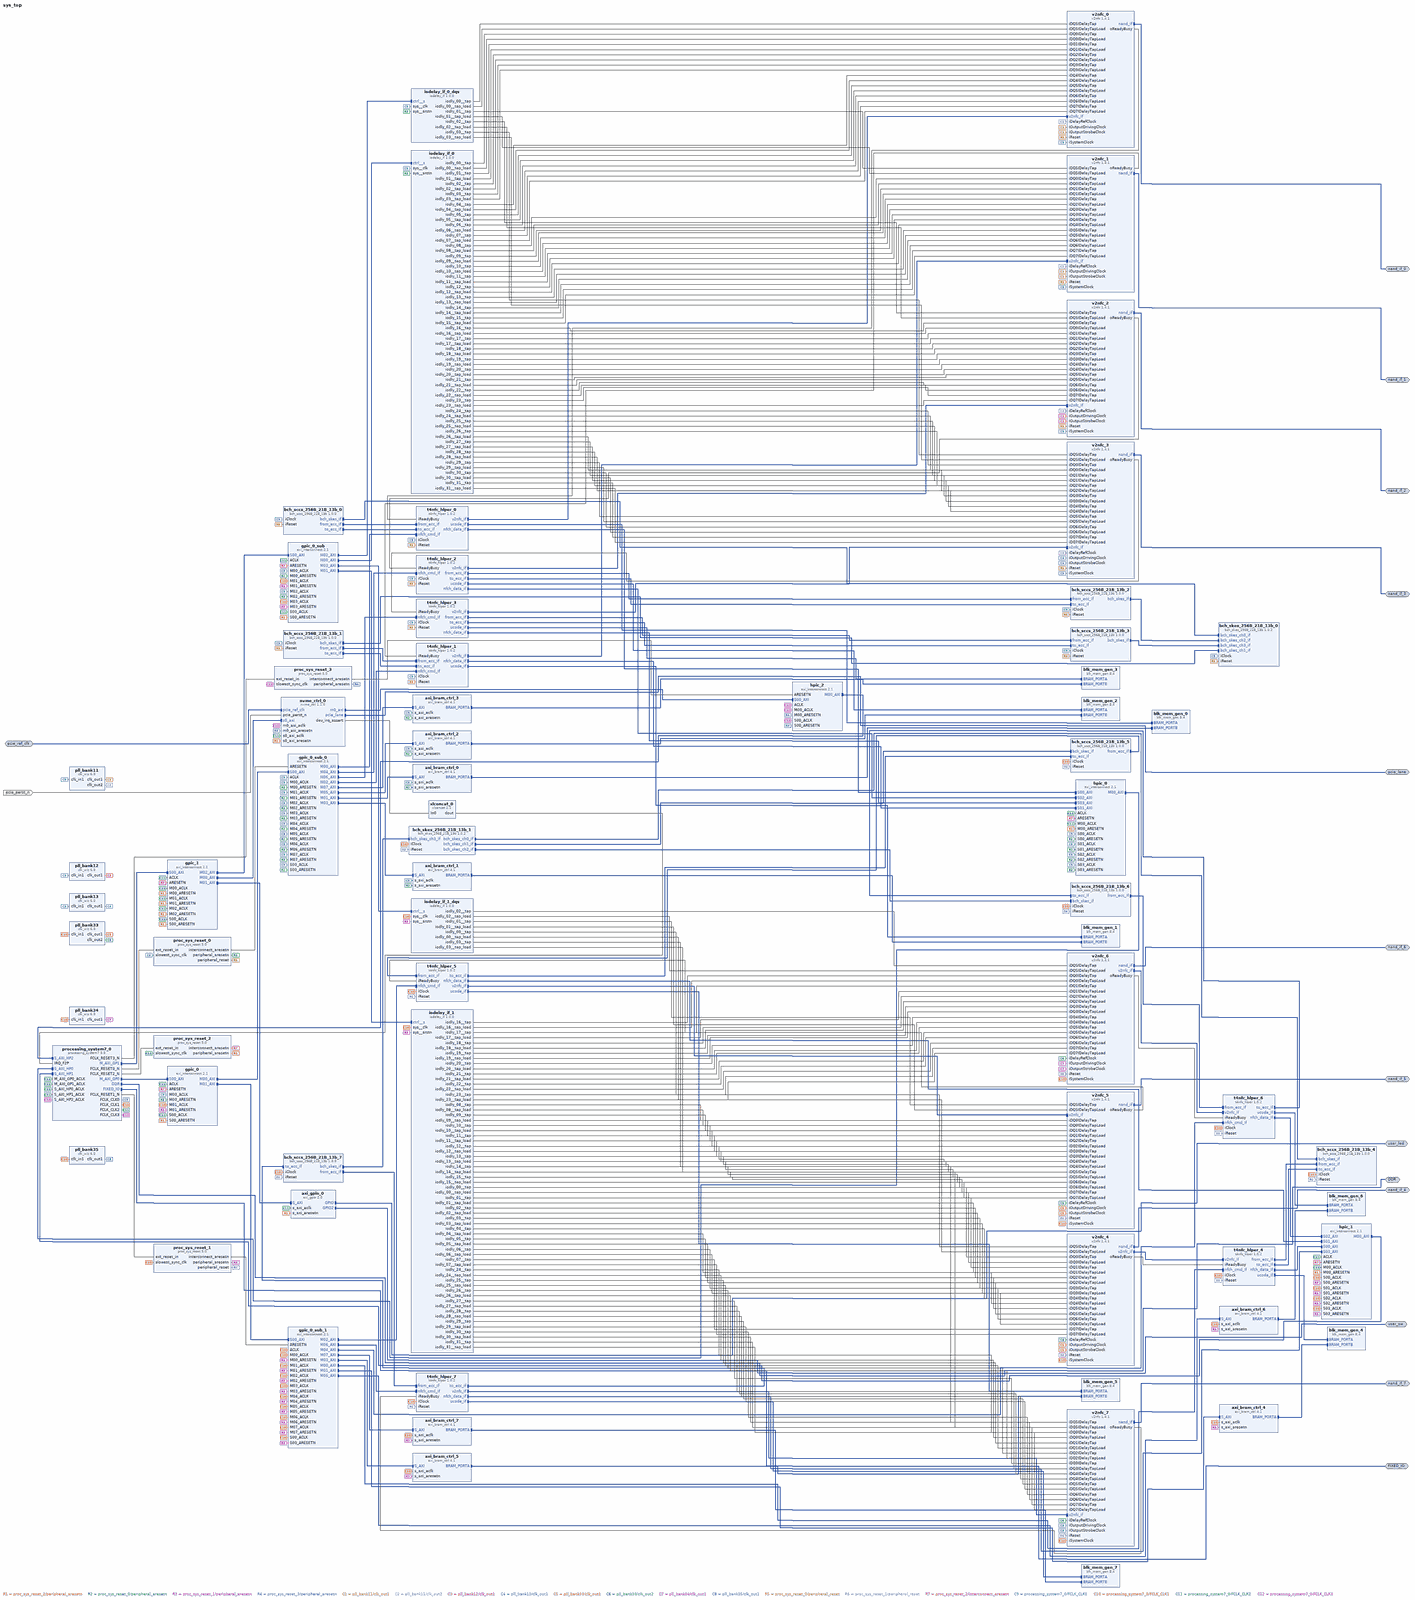
[diagram p0: block diagram of the top level, whole]
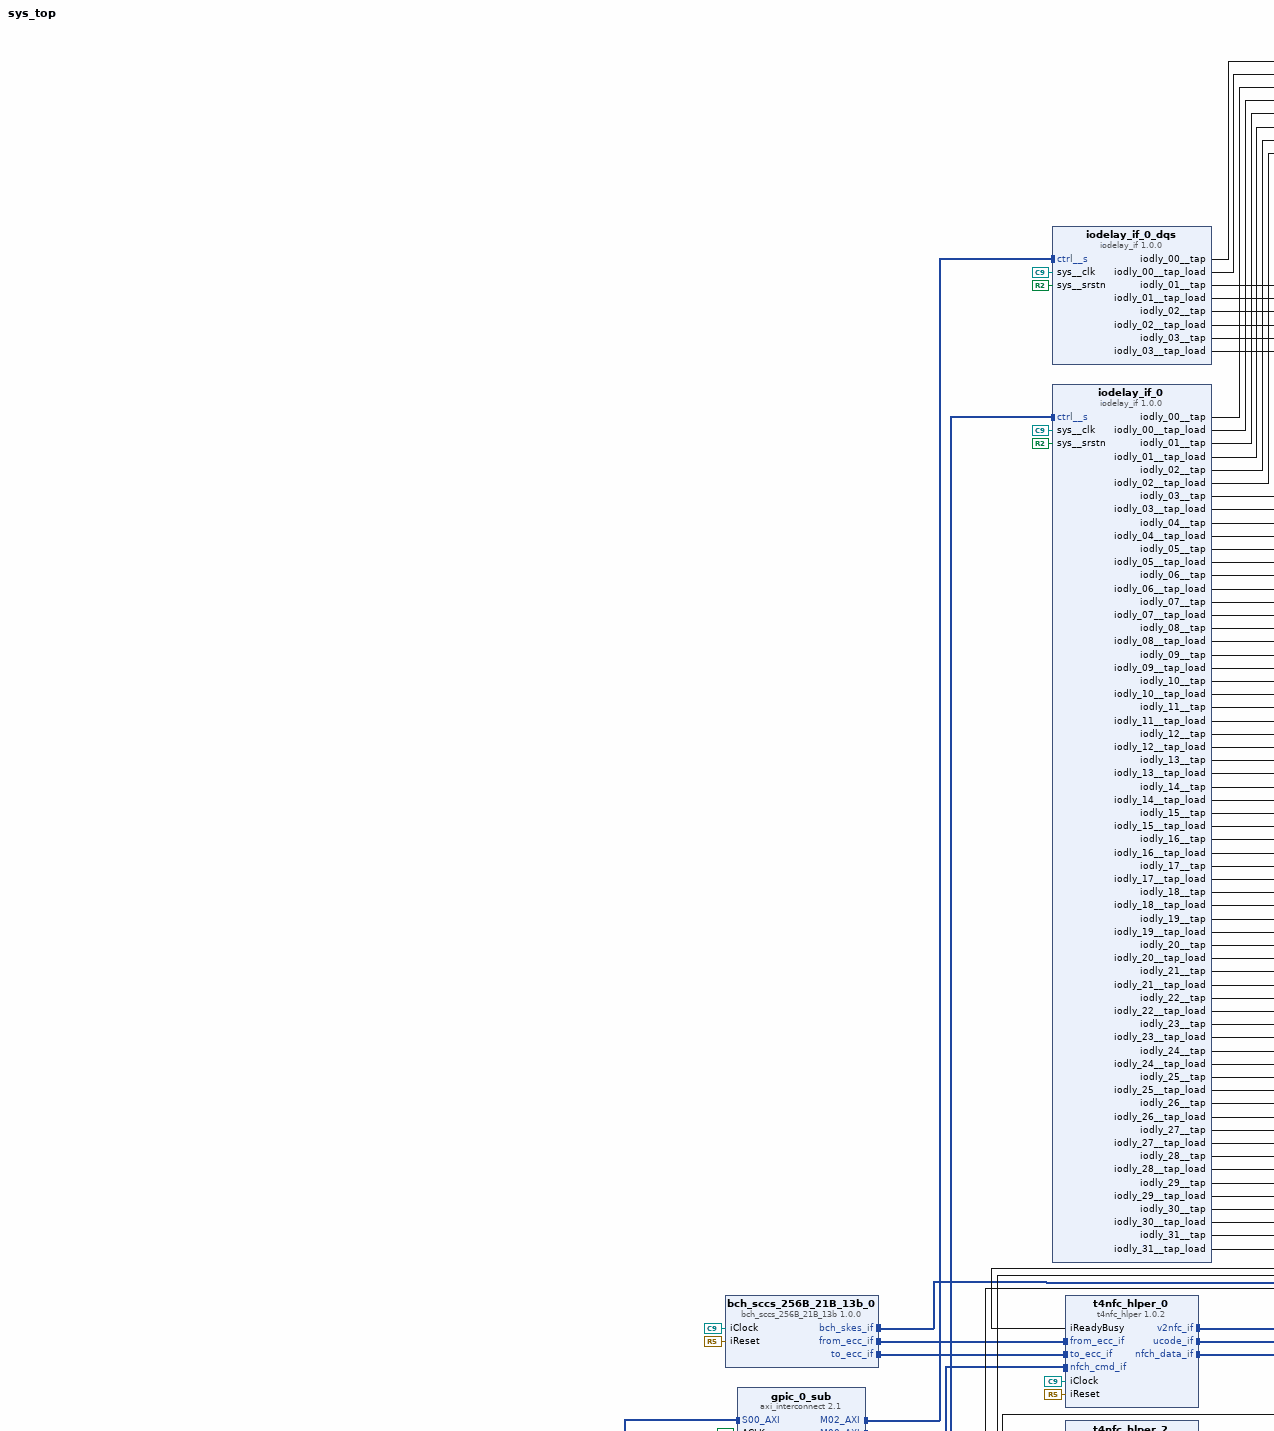
[diagram p1: block diagram of the top level, upper left part]
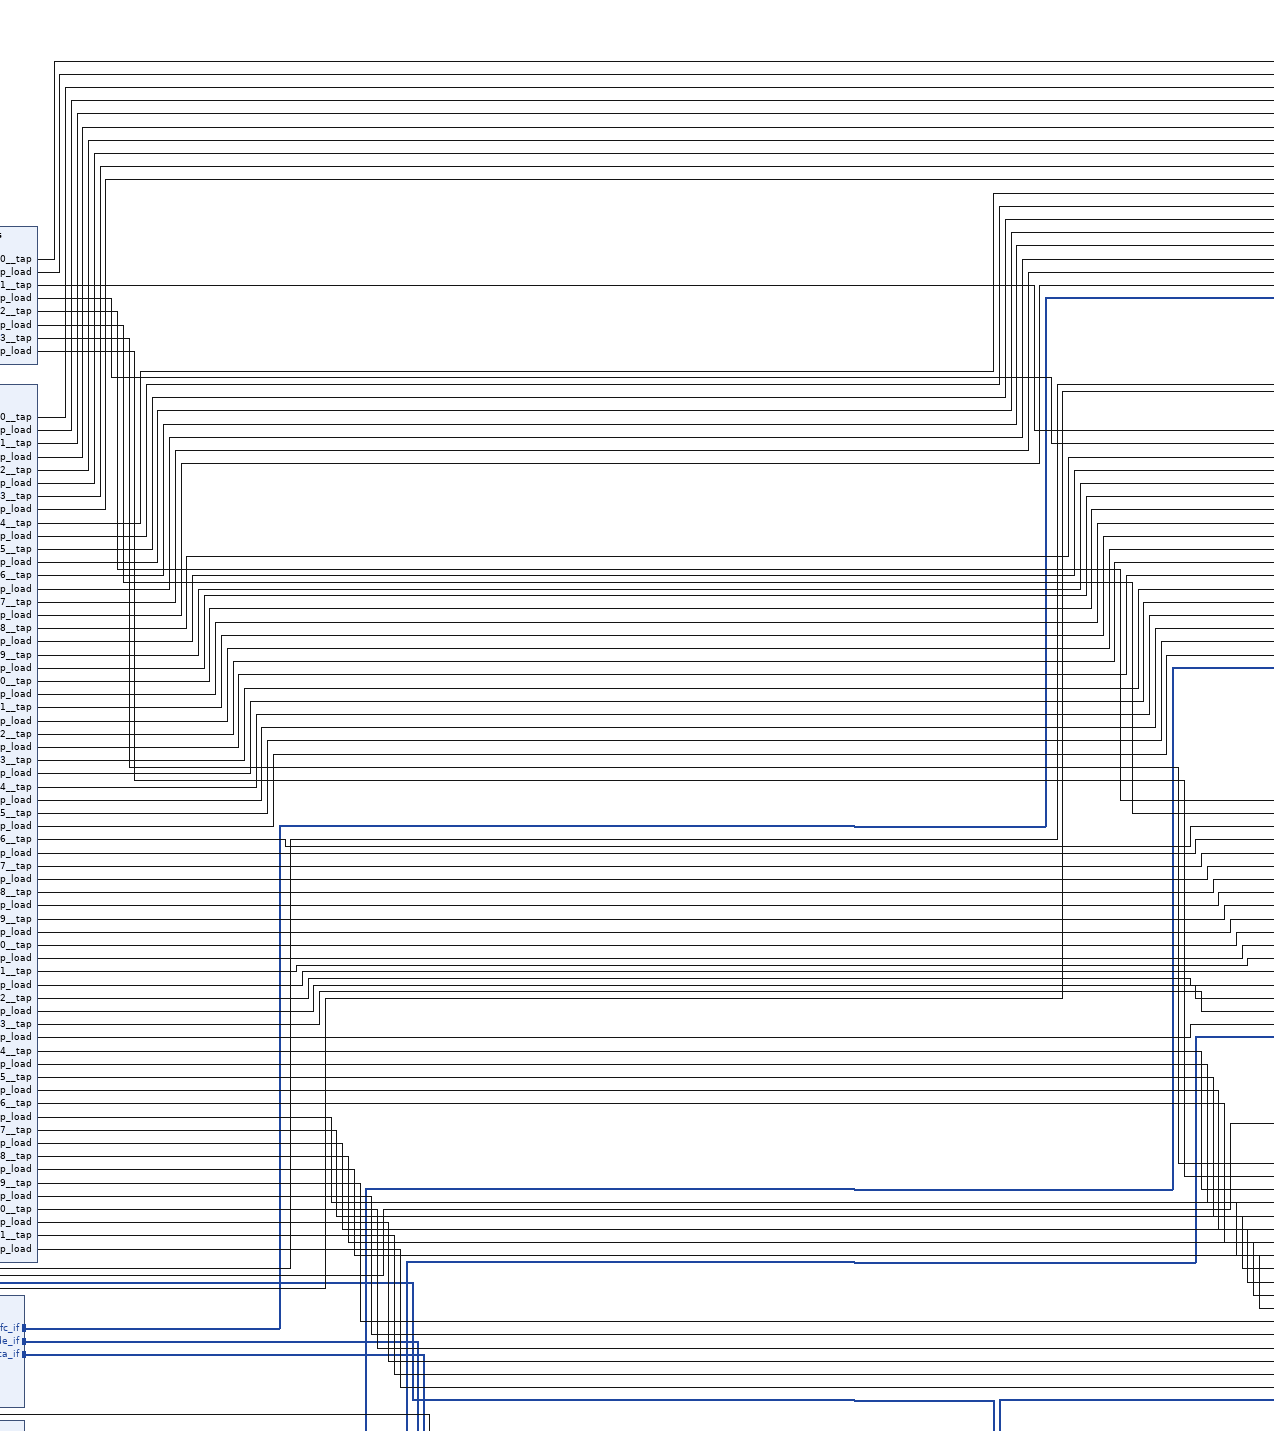
[diagram p2: block diagram of the top level, upper centre part]
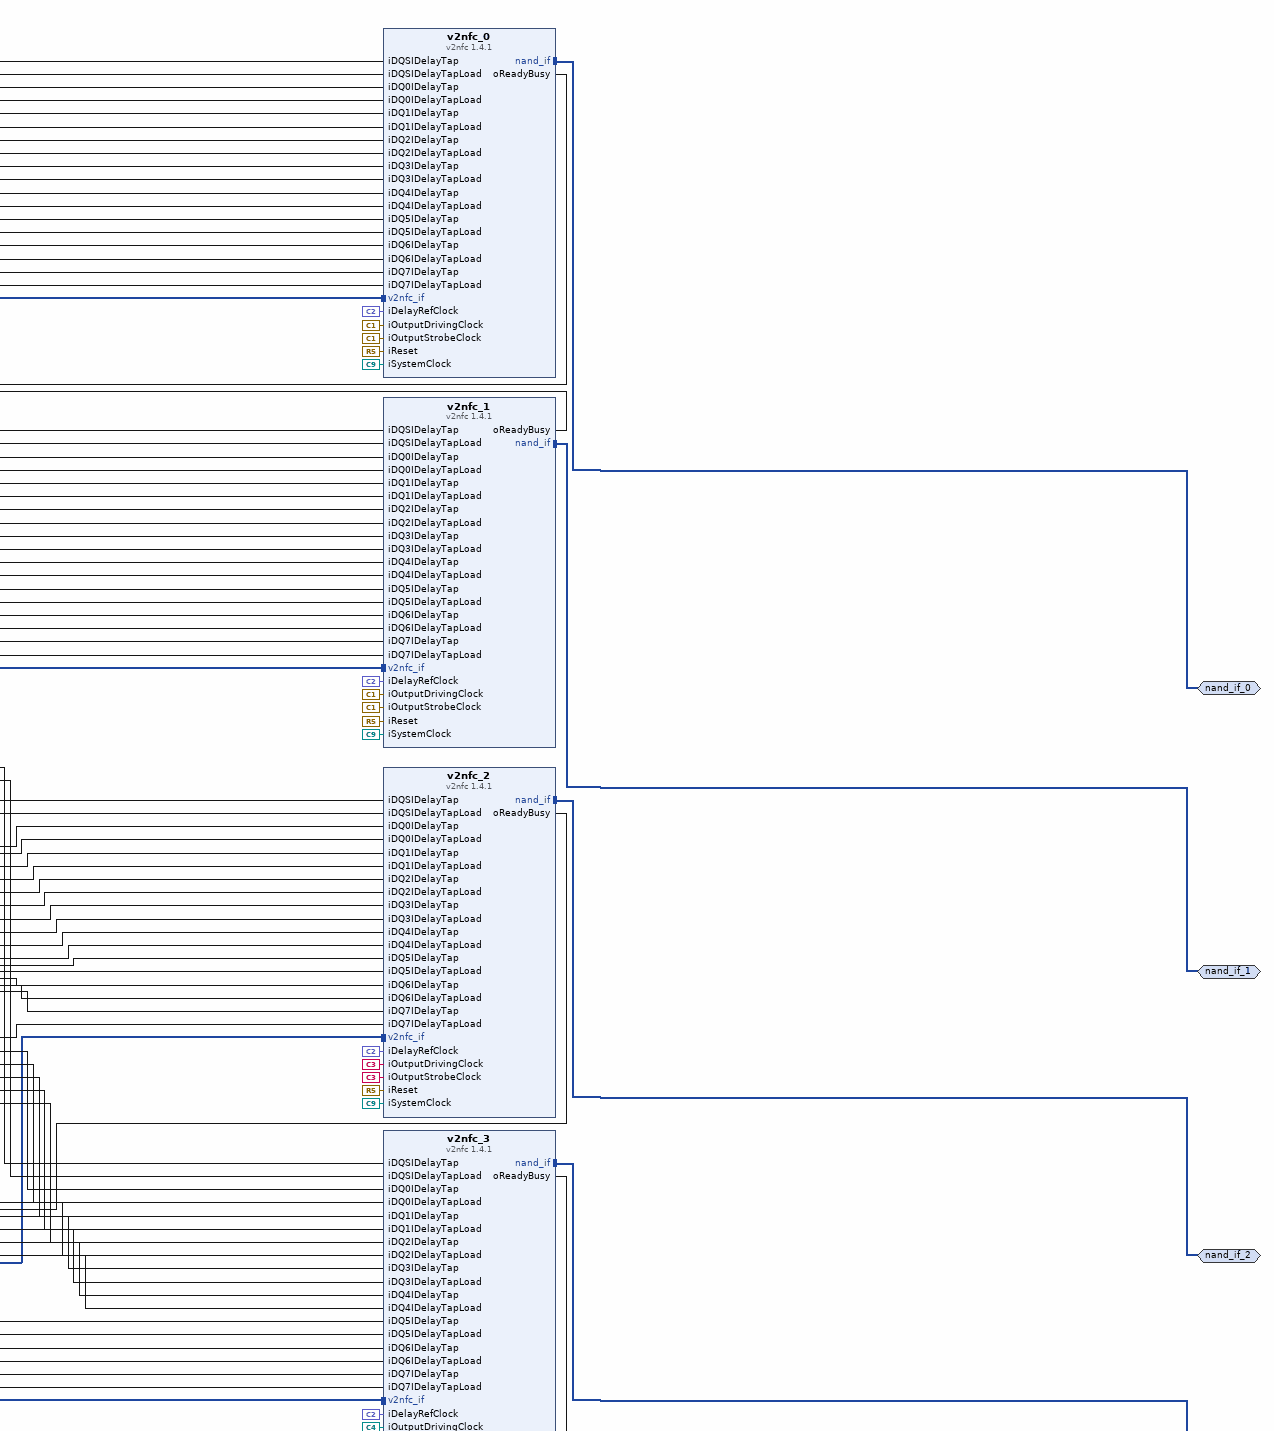
[diagram p3: block diagram of the top level, upper right part]
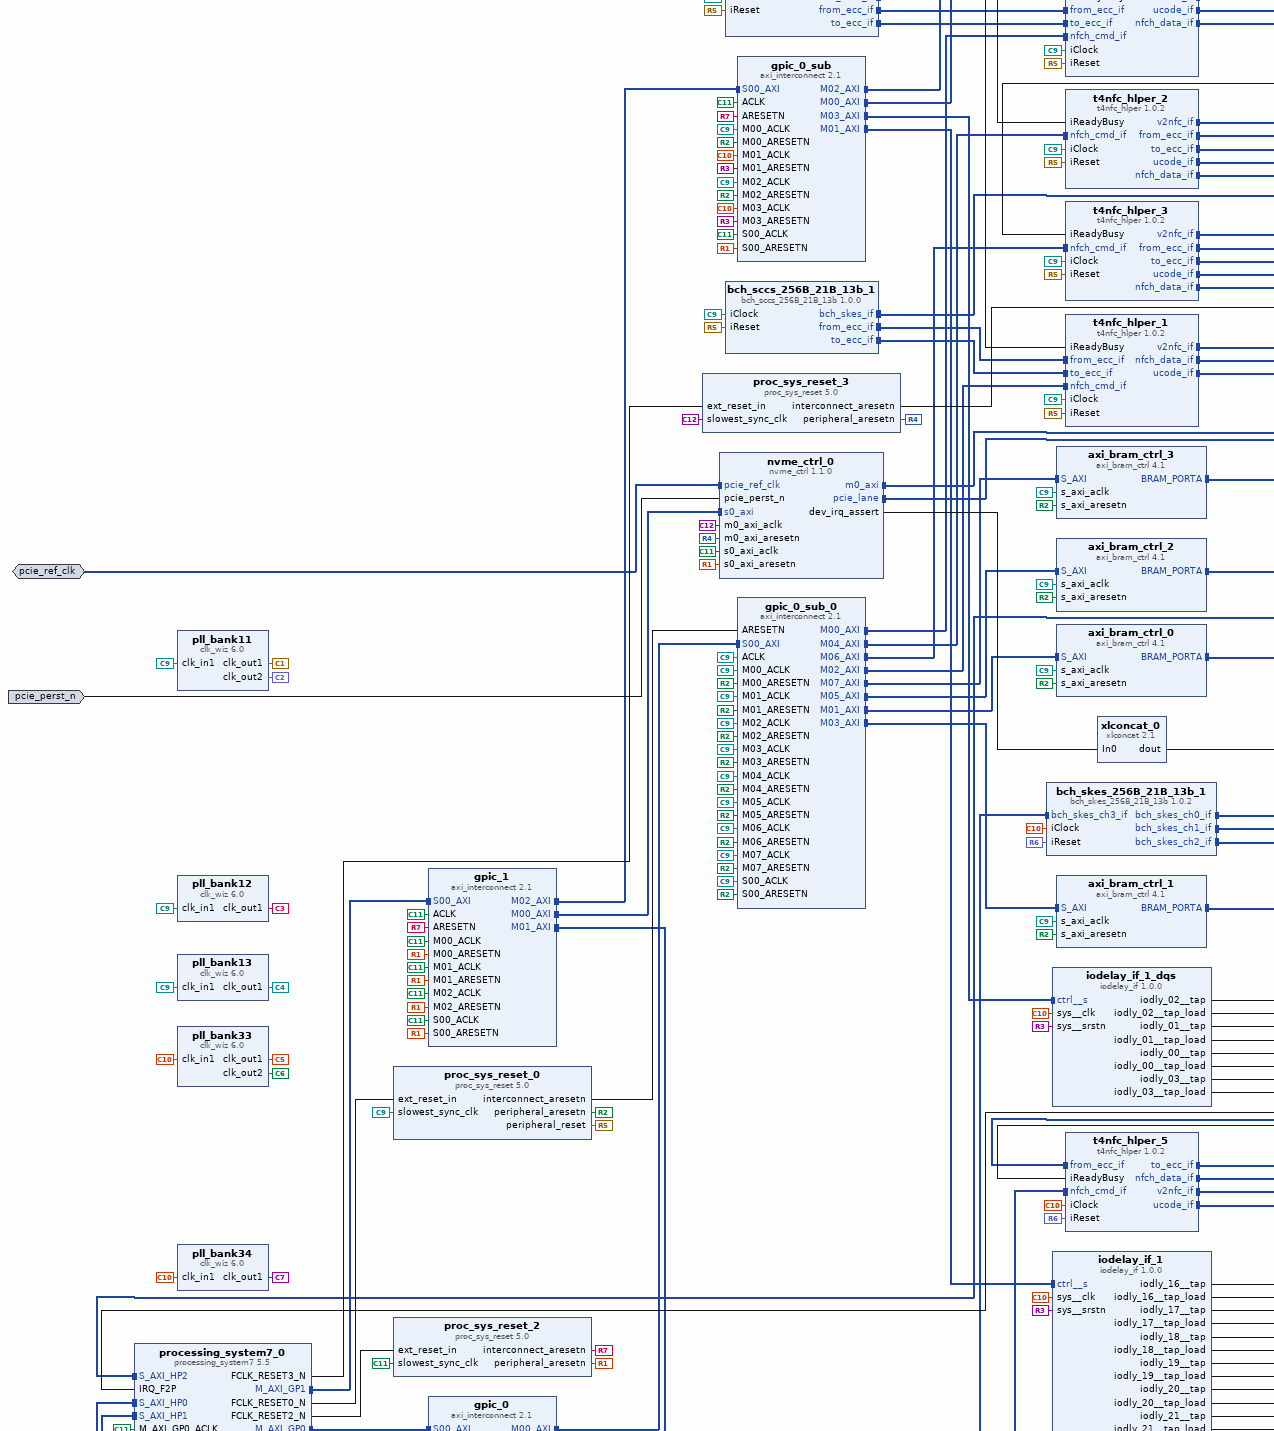
[diagram p4: block diagram of the top level, middle left part]
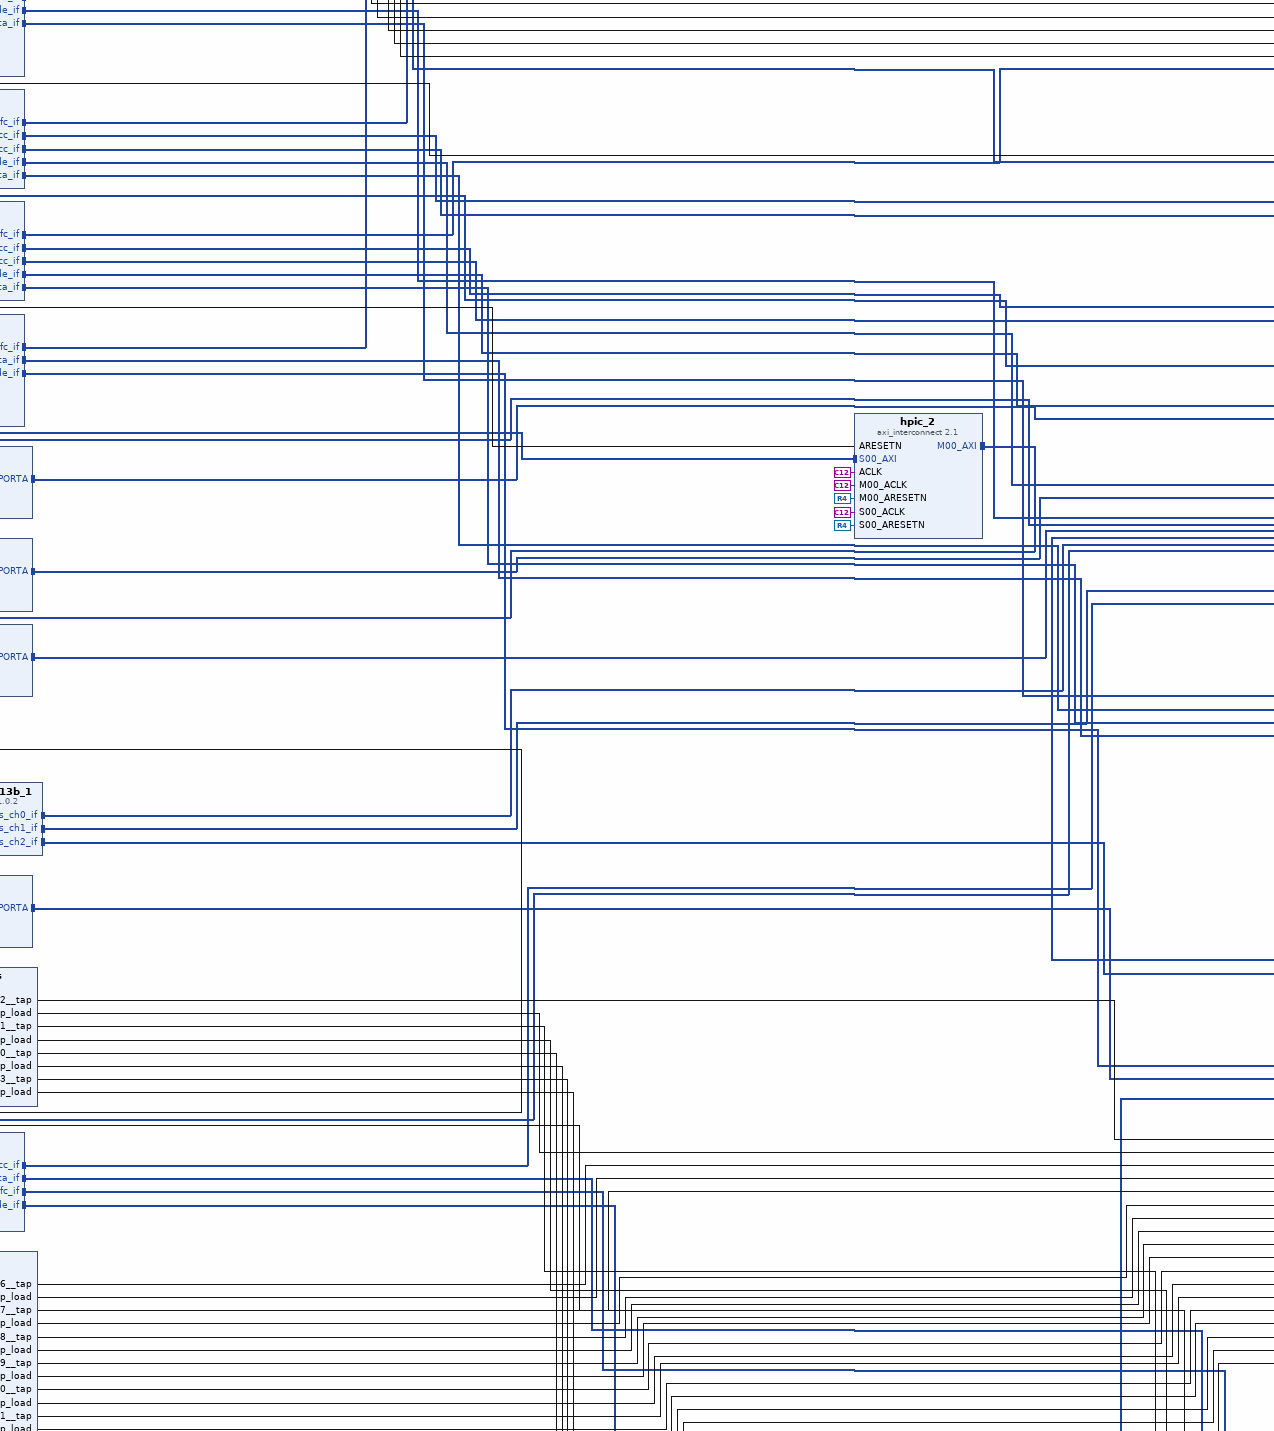
[diagram p5: block diagram of the top level, middle centre part]
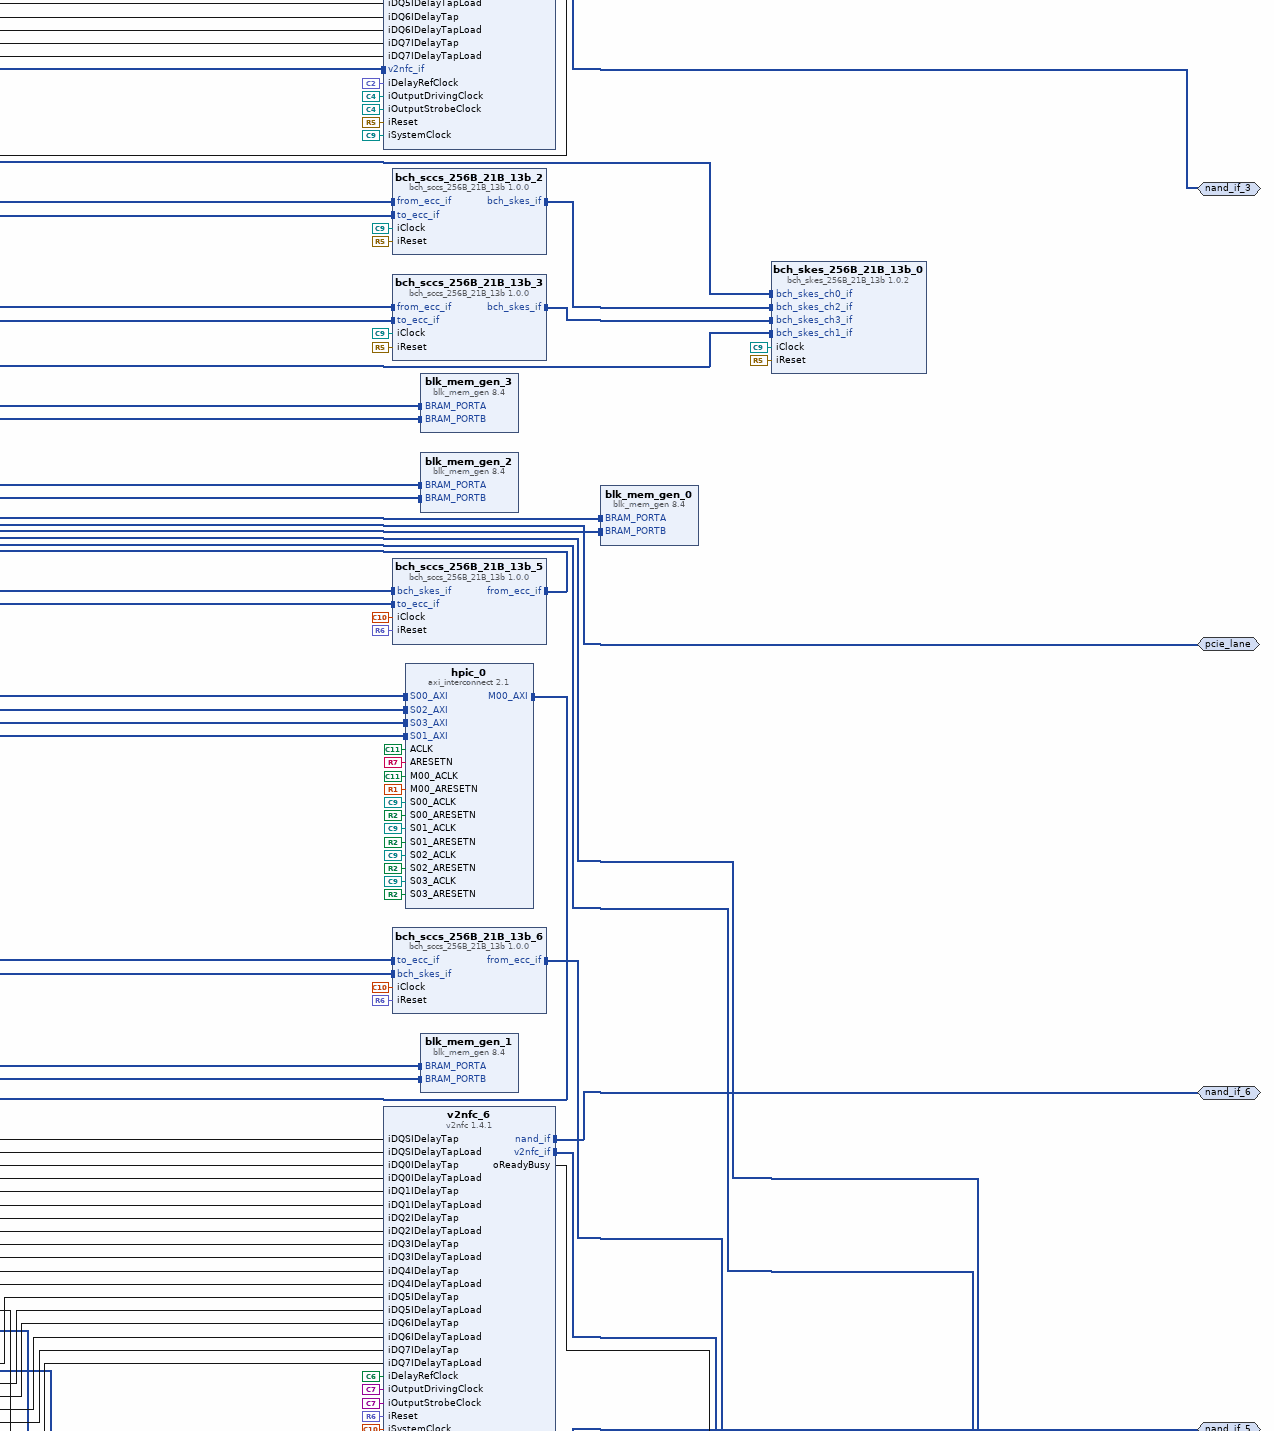
[diagram p6: block diagram of the top level, middle right part]
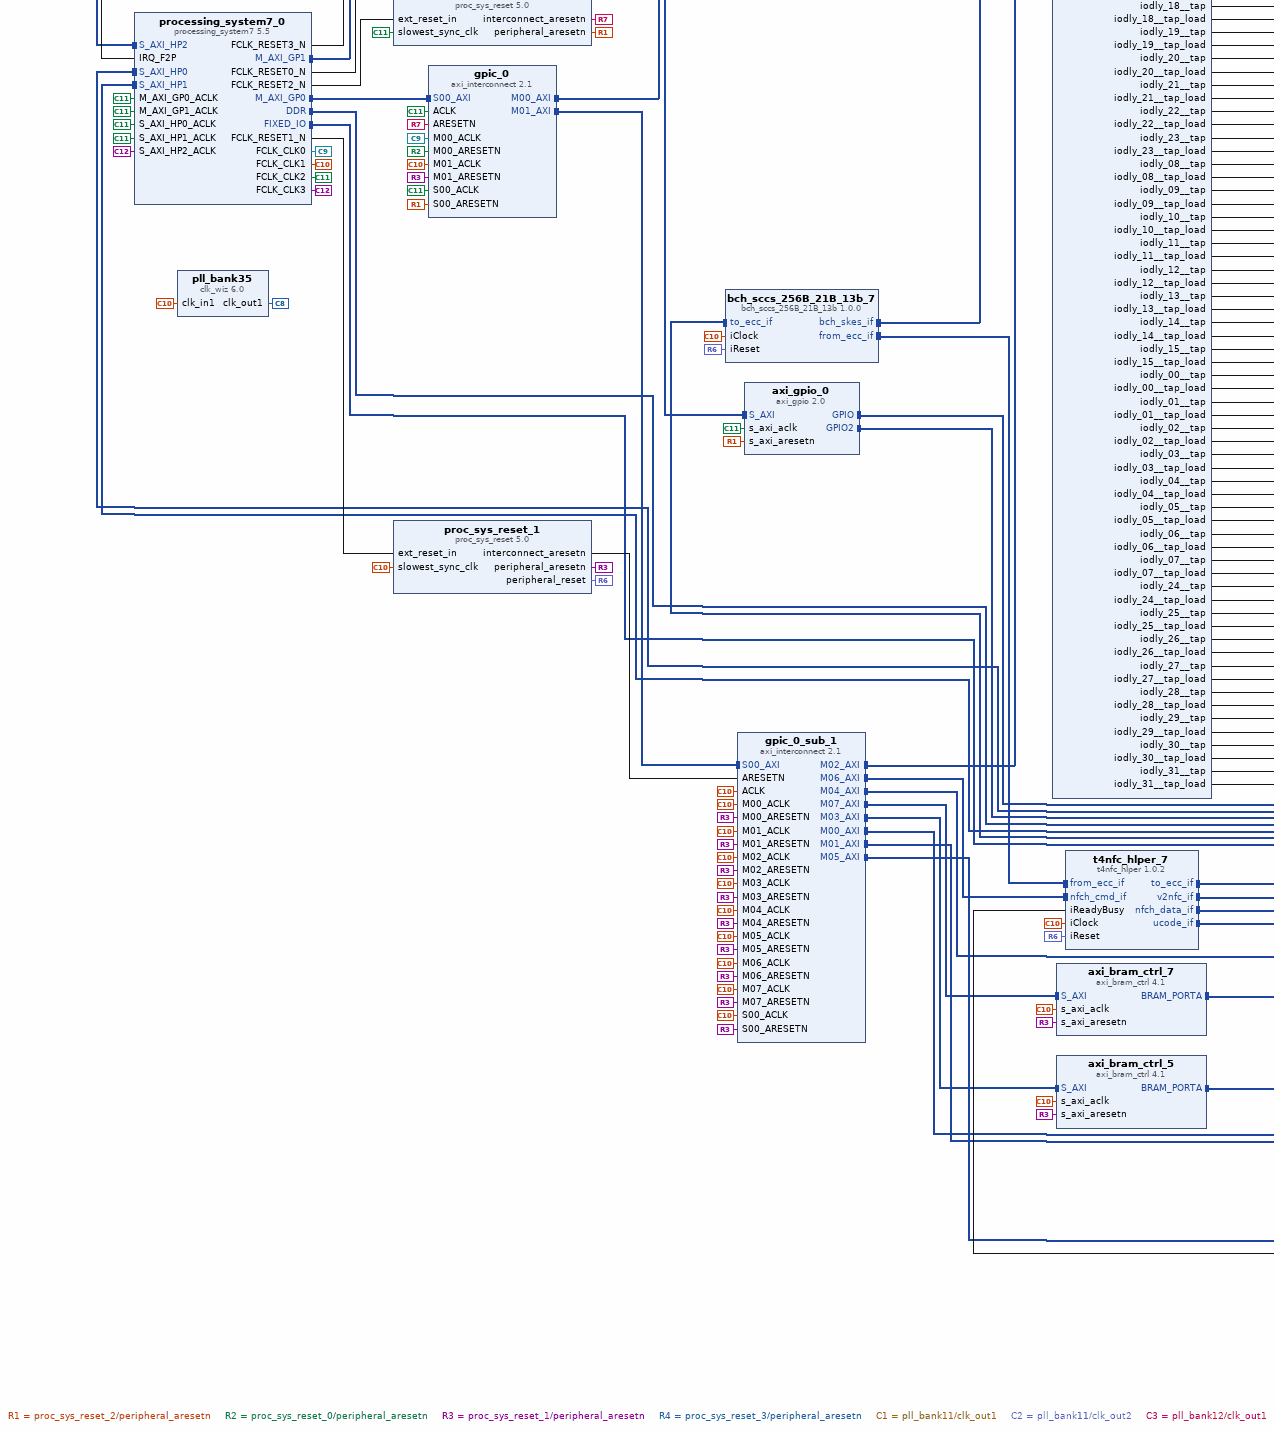
[diagram p7: block diagram of the top level, lower left part]
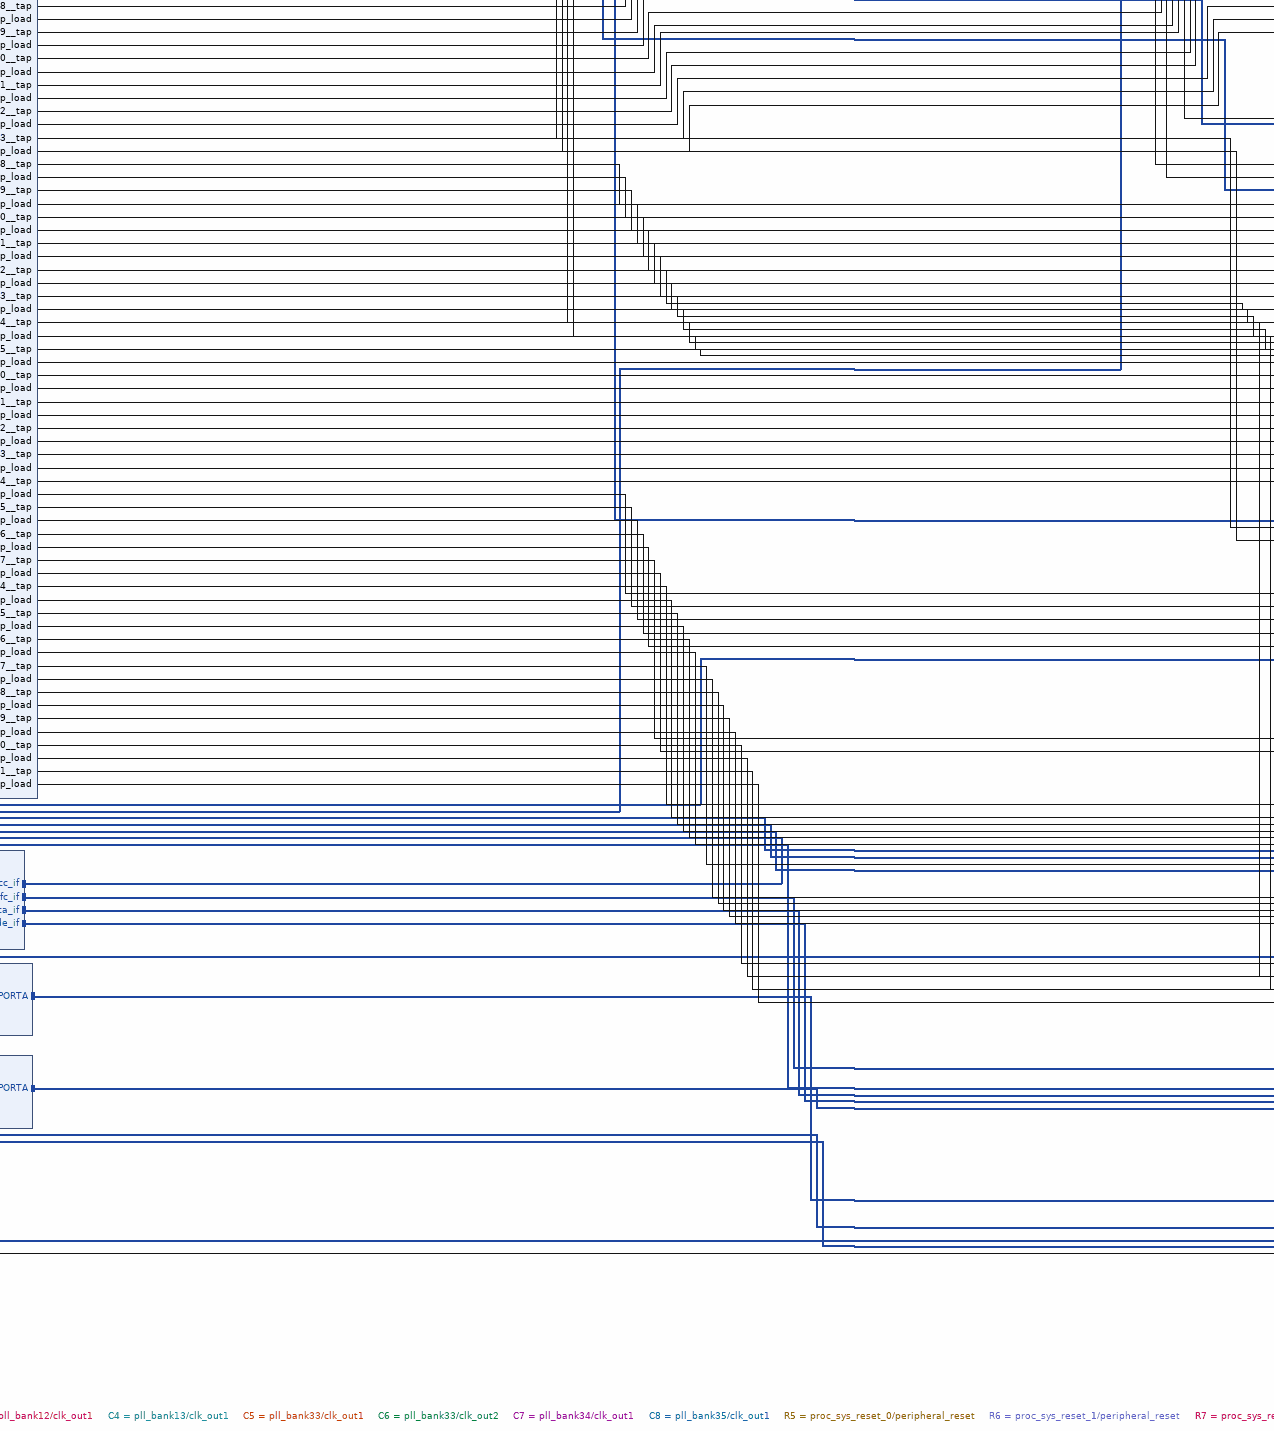
[diagram p8: block diagram of the top level, lower centre part]
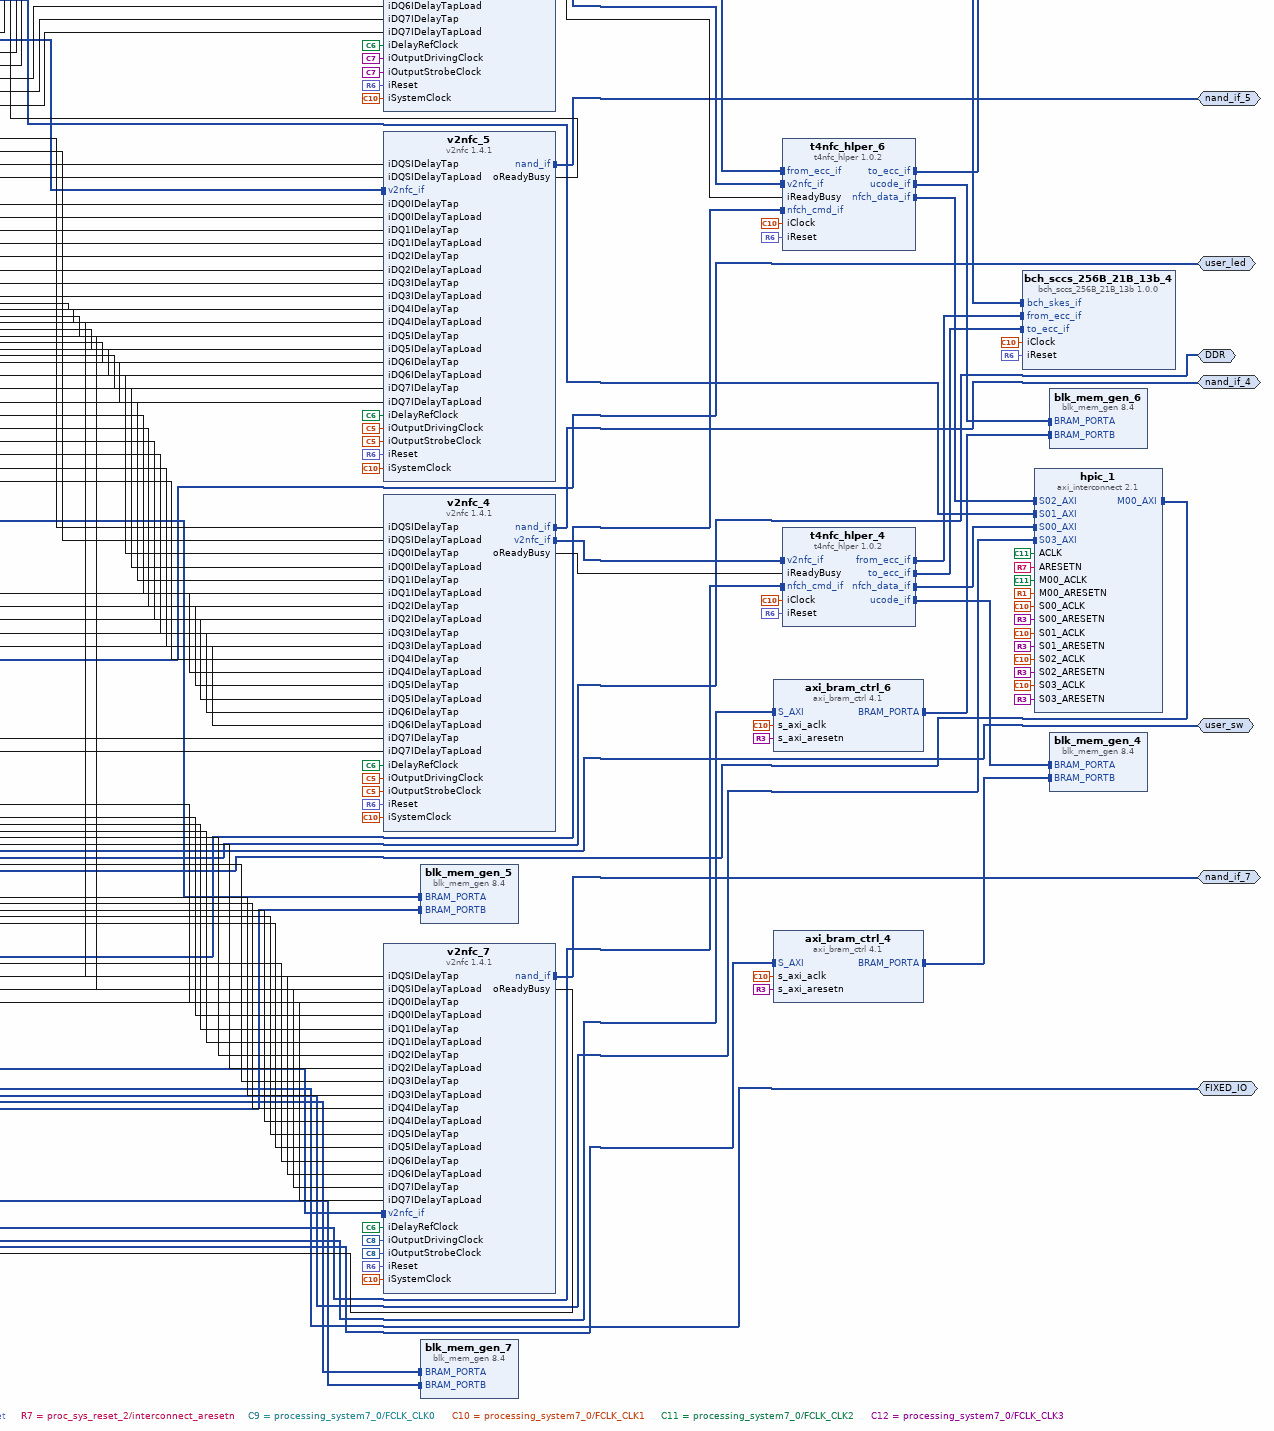
[diagram p9: block diagram of the top level, lower right part]
# Vivado block design sys_top, xc7z045ffg900-3, Vivado 2025.1
create_bd_design sys_top

create_bd_intf_port -mode Master -vlnv xilinx.com:interface:ddrx_rtl:1.0 DDR
create_bd_intf_port -mode Master -vlnv xilinx.com:display_processing_system7:fixedio_rtl:1.0 FIXED_IO
create_bd_intf_port -mode Master -vlnv xilinx.com:interface:gpio_rtl:1.0 user_led
create_bd_intf_port -mode Master -vlnv xilinx.com:interface:gpio_rtl:1.0 user_sw
create_bd_intf_port -mode Master -vlnv xilinx.com:interface:pcie_7x_mgt_rtl:1.0 pcie_lane
create_bd_intf_port -mode Slave -vlnv xilinx.com:interface:diff_clock_rtl:1.0 pcie_ref_clk
create_bd_intf_port -mode Master -vlnv enclab:user:nand_if_rtl:1.0 nand_if_0
create_bd_intf_port -mode Master -vlnv enclab:user:nand_if_rtl:1.0 nand_if_1
create_bd_intf_port -mode Master -vlnv enclab:user:nand_if_rtl:1.0 nand_if_2
create_bd_intf_port -mode Master -vlnv enclab:user:nand_if_rtl:1.0 nand_if_3
create_bd_intf_port -mode Master -vlnv enclab:user:nand_if_rtl:1.0 nand_if_4
create_bd_intf_port -mode Master -vlnv enclab:user:nand_if_rtl:1.0 nand_if_5
create_bd_intf_port -mode Master -vlnv enclab:user:nand_if_rtl:1.0 nand_if_6
create_bd_intf_port -mode Master -vlnv enclab:user:nand_if_rtl:1.0 nand_if_7
create_bd_port -dir I -type rst pcie_perst_n

create_bd_cell -type ip -vlnv xilinx.com:ip:processing_system7:5.5 processing_system7_0
set_property -dict [list \
  CONFIG.PCW_APU_PERIPHERAL_FREQMHZ 1000 \
  CONFIG.PCW_CPU_CPU_6X4X_MAX_RANGE 1000 \
  CONFIG.PCW_CRYSTAL_PERIPHERAL_FREQMHZ 33.3333333 \
  CONFIG.PCW_DUAL_PARALLEL_QSPI_DATA_MODE x8 \
  CONFIG.PCW_ENET0_ENET0_IO {MIO 16 .. 27} \
  CONFIG.PCW_ENET0_GRP_MDIO_ENABLE 1 \
  CONFIG.PCW_ENET0_GRP_MDIO_IO {MIO 52 .. 53} \
  CONFIG.PCW_ENET0_PERIPHERAL_ENABLE 1 \
  CONFIG.PCW_EN_CLK1_PORT 1 \
  CONFIG.PCW_EN_CLK2_PORT 1 \
  CONFIG.PCW_EN_CLK3_PORT 1 \
  CONFIG.PCW_EN_RST1_PORT 1 \
  CONFIG.PCW_EN_RST2_PORT 1 \
  CONFIG.PCW_EN_RST3_PORT 1 \
  CONFIG.PCW_FCLK_CLK1_BUF TRUE \
  CONFIG.PCW_FCLK_CLK2_BUF TRUE \
  CONFIG.PCW_FCLK_CLK3_BUF TRUE \
  CONFIG.PCW_FPGA0_PERIPHERAL_FREQMHZ 66.66666666 \
  CONFIG.PCW_FPGA1_PERIPHERAL_FREQMHZ 66.66666666 \
  CONFIG.PCW_FPGA2_PERIPHERAL_FREQMHZ 200 \
  CONFIG.PCW_FPGA3_PERIPHERAL_FREQMHZ 250 \
  CONFIG.PCW_FPGA_FCLK1_ENABLE 1 \
  CONFIG.PCW_FPGA_FCLK2_ENABLE 1 \
  CONFIG.PCW_FPGA_FCLK3_ENABLE 1 \
  CONFIG.PCW_GPIO_MIO_GPIO_ENABLE 0 \
  CONFIG.PCW_I2C0_GRP_INT_ENABLE 0 \
  CONFIG.PCW_I2C0_I2C0_IO {MIO 50 .. 51} \
  CONFIG.PCW_I2C0_PERIPHERAL_ENABLE 1 \
  CONFIG.PCW_I2C_PERIPHERAL_FREQMHZ 166.666672 \
  CONFIG.PCW_IRQ_F2P_INTR 1 \
  CONFIG.PCW_PERIPHERAL_BOARD_PRESET None \
  CONFIG.PCW_PRESET_BANK0_VOLTAGE {LVCMOS 1.8V} \
  CONFIG.PCW_PRESET_BANK1_VOLTAGE {LVCMOS 1.8V} \
  CONFIG.PCW_QSPI_GRP_FBCLK_ENABLE 1 \
  CONFIG.PCW_QSPI_GRP_FBCLK_IO {MIO 8} \
  CONFIG.PCW_QSPI_GRP_IO1_ENABLE 1 \
  CONFIG.PCW_QSPI_GRP_IO1_IO {MIO 0 9 .. 13} \
  CONFIG.PCW_QSPI_GRP_SINGLE_SS_ENABLE 0 \
  CONFIG.PCW_QSPI_INTERNAL_HIGHADDRESS 0xFDFFFFFF \
  CONFIG.PCW_QSPI_PERIPHERAL_ENABLE 1 \
  CONFIG.PCW_QSPI_QSPI_IO {MIO 1 .. 6} \
  CONFIG.PCW_SD0_GRP_CD_ENABLE 1 \
  CONFIG.PCW_SD0_GRP_CD_IO {MIO 14} \
  CONFIG.PCW_SD0_GRP_WP_ENABLE 1 \
  CONFIG.PCW_SD0_GRP_WP_IO {MIO 15} \
  CONFIG.PCW_SD0_PERIPHERAL_ENABLE 1 \
  CONFIG.PCW_SD0_SD0_IO {MIO 40 .. 45} \
  CONFIG.PCW_SDIO_PERIPHERAL_FREQMHZ 100 \
  CONFIG.PCW_UART1_PERIPHERAL_ENABLE 1 \
  CONFIG.PCW_UART1_UART1_IO {MIO 48 .. 49} \
  CONFIG.PCW_UART_PERIPHERAL_FREQMHZ 100 \
  CONFIG.PCW_UIPARAM_DDR_FREQ_MHZ 667 \
  CONFIG.PCW_UIPARAM_DDR_PARTNO Custom \
  CONFIG.PCW_USB0_PERIPHERAL_ENABLE 0 \
  CONFIG.PCW_USE_FABRIC_INTERRUPT 1 \
  CONFIG.PCW_USE_M_AXI_GP1 1 \
  CONFIG.PCW_USE_S_AXI_HP0 1 \
  CONFIG.PCW_USE_S_AXI_HP1 1 \
  CONFIG.PCW_USE_S_AXI_HP2 1 \
  CONFIG.preset None \
] [get_bd_cells processing_system7_0]
# 467 more settings of processing_system7_0 are not shown: defaults, MIO pin electricals, DDR timing, and values the tool derives
create_bd_cell -type ip -vlnv xilinx.com:ip:proc_sys_reset:5.0 proc_sys_reset_0
create_bd_cell -type ip -vlnv xilinx.com:ip:proc_sys_reset:5.0 proc_sys_reset_1
create_bd_cell -type ip -vlnv xilinx.com:ip:proc_sys_reset:5.0 proc_sys_reset_2
create_bd_cell -type ip -vlnv xilinx.com:ip:proc_sys_reset:5.0 proc_sys_reset_3
create_bd_cell -type ip -vlnv xilinx.com:ip:axi_interconnect:2.1 gpic_0_sub_0
set_property -dict [list \
  CONFIG.ENABLE_ADVANCED_OPTIONS 0 \
  CONFIG.NUM_MI 8 \
  CONFIG.S00_HAS_DATA_FIFO 2 \
  CONFIG.STRATEGY 2 \
] [get_bd_cells gpic_0_sub_0]
create_bd_cell -type ip -vlnv xilinx.com:ip:axi_interconnect:2.1 gpic_0_sub_1
set_property -dict [list \
  CONFIG.ENABLE_ADVANCED_OPTIONS 0 \
  CONFIG.NUM_MI 8 \
  CONFIG.S00_HAS_DATA_FIFO 2 \
  CONFIG.STRATEGY 2 \
] [get_bd_cells gpic_0_sub_1]
create_bd_cell -type ip -vlnv xilinx.com:ip:axi_interconnect:2.1 gpic_1
set_property -dict {CONFIG.NUM_MI 3 CONFIG.S00_HAS_DATA_FIFO 2 CONFIG.STRATEGY 0} [get_bd_cells gpic_1]
create_bd_cell -type ip -vlnv xilinx.com:ip:axi_interconnect:2.1 hpic_0
set_property -dict [list \
  CONFIG.ENABLE_ADVANCED_OPTIONS 0 \
  CONFIG.M00_HAS_DATA_FIFO 0 \
  CONFIG.NUM_MI 1 \
  CONFIG.NUM_SI 4 \
  CONFIG.S00_HAS_DATA_FIFO 2 \
  CONFIG.S00_HAS_REGSLICE 4 \
  CONFIG.S01_HAS_DATA_FIFO 2 \
  CONFIG.S01_HAS_REGSLICE 4 \
  CONFIG.S02_HAS_DATA_FIFO 2 \
  CONFIG.S02_HAS_REGSLICE 4 \
  CONFIG.S03_HAS_DATA_FIFO 2 \
  CONFIG.S03_HAS_REGSLICE 4 \
  CONFIG.STRATEGY 2 \
  CONFIG.SYNCHRONIZATION_STAGES 4 \
  CONFIG.XBAR_DATA_WIDTH 64 \
] [get_bd_cells hpic_0]
create_bd_cell -type ip -vlnv xilinx.com:ip:axi_interconnect:2.1 hpic_1
set_property -dict [list \
  CONFIG.ENABLE_ADVANCED_OPTIONS 0 \
  CONFIG.M00_HAS_DATA_FIFO 0 \
  CONFIG.NUM_MI 1 \
  CONFIG.NUM_SI 4 \
  CONFIG.S00_HAS_DATA_FIFO 2 \
  CONFIG.S00_HAS_REGSLICE 4 \
  CONFIG.S01_HAS_DATA_FIFO 2 \
  CONFIG.S01_HAS_REGSLICE 4 \
  CONFIG.S02_HAS_DATA_FIFO 2 \
  CONFIG.S02_HAS_REGSLICE 4 \
  CONFIG.S03_HAS_DATA_FIFO 2 \
  CONFIG.S03_HAS_REGSLICE 4 \
  CONFIG.STRATEGY 2 \
  CONFIG.SYNCHRONIZATION_STAGES 4 \
  CONFIG.XBAR_DATA_WIDTH 64 \
] [get_bd_cells hpic_1]
create_bd_cell -type ip -vlnv xilinx.com:ip:axi_interconnect:2.1 hpic_2
set_property -dict [list \
  CONFIG.ENABLE_ADVANCED_OPTIONS 1 \
  CONFIG.NUM_MI 1 \
  CONFIG.NUM_SI 1 \
  CONFIG.S00_HAS_DATA_FIFO 2 \
  CONFIG.S01_HAS_DATA_FIFO 2 \
  CONFIG.S02_HAS_DATA_FIFO 2 \
  CONFIG.S03_HAS_DATA_FIFO 2 \
  CONFIG.STRATEGY 0 \
] [get_bd_cells hpic_2]
create_bd_cell -type ip -vlnv xilinx.com:ip:axi_gpio:2.0 axi_gpio_0
set_property -dict [list \
  CONFIG.C_ALL_INPUTS 0 \
  CONFIG.C_ALL_INPUTS_2 1 \
  CONFIG.C_ALL_OUTPUTS 1 \
  CONFIG.C_GPIO2_WIDTH 8 \
  CONFIG.C_GPIO_WIDTH 8 \
  CONFIG.C_IS_DUAL 1 \
] [get_bd_cells axi_gpio_0]
create_bd_cell -type ip -vlnv xilinx.com:ip:axi_bram_ctrl:4.1 axi_bram_ctrl_0
set_property -dict {CONFIG.SINGLE_PORT_BRAM 1} [get_bd_cells axi_bram_ctrl_0]
create_bd_cell -type ip -vlnv xilinx.com:ip:axi_bram_ctrl:4.1 axi_bram_ctrl_1
set_property -dict {CONFIG.SINGLE_PORT_BRAM 1} [get_bd_cells axi_bram_ctrl_1]
create_bd_cell -type ip -vlnv xilinx.com:ip:axi_bram_ctrl:4.1 axi_bram_ctrl_2
set_property -dict {CONFIG.SINGLE_PORT_BRAM 1} [get_bd_cells axi_bram_ctrl_2]
create_bd_cell -type ip -vlnv xilinx.com:ip:axi_bram_ctrl:4.1 axi_bram_ctrl_3
set_property -dict {CONFIG.SINGLE_PORT_BRAM 1} [get_bd_cells axi_bram_ctrl_3]
create_bd_cell -type ip -vlnv xilinx.com:ip:blk_mem_gen:8.4 blk_mem_gen_0
set_property -dict [list \
  CONFIG.Assume_Synchronous_Clk true \
  CONFIG.EN_SAFETY_CKT false \
  CONFIG.Enable_32bit_Address true \
  CONFIG.Enable_B Use_ENB_Pin \
  CONFIG.Memory_Type True_Dual_Port_RAM \
  CONFIG.Port_B_Clock 100 \
  CONFIG.Port_B_Enable_Rate 100 \
  CONFIG.Port_B_Write_Rate 50 \
  CONFIG.Register_PortA_Output_of_Memory_Primitives false \
  CONFIG.Register_PortB_Output_of_Memory_Primitives false \
  CONFIG.Use_RSTA_Pin true \
  CONFIG.Use_RSTB_Pin true \
  CONFIG.Write_Depth_A 2048 \
  CONFIG.use_bram_block Stand_Alone \
] [get_bd_cells blk_mem_gen_0]
create_bd_cell -type ip -vlnv xilinx.com:ip:blk_mem_gen:8.4 blk_mem_gen_1
set_property -dict [list \
  CONFIG.Assume_Synchronous_Clk true \
  CONFIG.EN_SAFETY_CKT false \
  CONFIG.Enable_32bit_Address true \
  CONFIG.Enable_B Use_ENB_Pin \
  CONFIG.Memory_Type True_Dual_Port_RAM \
  CONFIG.Port_B_Clock 100 \
  CONFIG.Port_B_Enable_Rate 100 \
  CONFIG.Port_B_Write_Rate 50 \
  CONFIG.Register_PortA_Output_of_Memory_Primitives false \
  CONFIG.Register_PortB_Output_of_Memory_Primitives false \
  CONFIG.Use_RSTA_Pin true \
  CONFIG.Use_RSTB_Pin true \
  CONFIG.Write_Depth_A 2048 \
  CONFIG.use_bram_block Stand_Alone \
] [get_bd_cells blk_mem_gen_1]
create_bd_cell -type ip -vlnv xilinx.com:ip:blk_mem_gen:8.4 blk_mem_gen_2
set_property -dict [list \
  CONFIG.Assume_Synchronous_Clk true \
  CONFIG.EN_SAFETY_CKT false \
  CONFIG.Enable_32bit_Address true \
  CONFIG.Enable_B Use_ENB_Pin \
  CONFIG.Memory_Type True_Dual_Port_RAM \
  CONFIG.Port_B_Clock 100 \
  CONFIG.Port_B_Enable_Rate 100 \
  CONFIG.Port_B_Write_Rate 50 \
  CONFIG.Register_PortA_Output_of_Memory_Primitives false \
  CONFIG.Register_PortB_Output_of_Memory_Primitives false \
  CONFIG.Use_RSTA_Pin true \
  CONFIG.Use_RSTB_Pin true \
  CONFIG.Write_Depth_A 2048 \
  CONFIG.use_bram_block Stand_Alone \
] [get_bd_cells blk_mem_gen_2]
create_bd_cell -type ip -vlnv xilinx.com:ip:blk_mem_gen:8.4 blk_mem_gen_3
set_property -dict [list \
  CONFIG.Assume_Synchronous_Clk true \
  CONFIG.EN_SAFETY_CKT false \
  CONFIG.Enable_32bit_Address true \
  CONFIG.Enable_B Use_ENB_Pin \
  CONFIG.Memory_Type True_Dual_Port_RAM \
  CONFIG.Port_B_Clock 100 \
  CONFIG.Port_B_Enable_Rate 100 \
  CONFIG.Port_B_Write_Rate 50 \
  CONFIG.Register_PortA_Output_of_Memory_Primitives false \
  CONFIG.Register_PortB_Output_of_Memory_Primitives false \
  CONFIG.Use_RSTA_Pin true \
  CONFIG.Use_RSTB_Pin true \
  CONFIG.Write_Depth_A 2048 \
  CONFIG.use_bram_block Stand_Alone \
] [get_bd_cells blk_mem_gen_3]
create_bd_cell -type ip -vlnv xilinx.com:ip:clk_wiz:6.0 pll_bank11
set_property -dict [list \
  CONFIG.CLKIN1_JITTER_PS 149.99 \
  CONFIG.CLKOUT1_DRIVES BUFG \
  CONFIG.CLKOUT1_JITTER 106.032 \
  CONFIG.CLKOUT1_PHASE_ERROR 122.499 \
  CONFIG.CLKOUT1_REQUESTED_OUT_FREQ 133.333 \
  CONFIG.CLKOUT1_REQUESTED_PHASE 0 \
  CONFIG.CLKOUT2_JITTER 99.160 \
  CONFIG.CLKOUT2_PHASE_ERROR 122.499 \
  CONFIG.CLKOUT2_REQUESTED_OUT_FREQ 200 \
  CONFIG.CLKOUT2_USED true \
  CONFIG.FEEDBACK_SOURCE FDBK_AUTO \
  CONFIG.JITTER_SEL Min_O_Jitter \
  CONFIG.MMCM_BANDWIDTH HIGH \
  CONFIG.MMCM_CLKFBOUT_MULT_F 21.000 \
  CONFIG.MMCM_CLKIN1_PERIOD 15.000 \
  CONFIG.MMCM_CLKIN2_PERIOD 10.0 \
  CONFIG.MMCM_CLKOUT0_DIVIDE_F 10.500 \
  CONFIG.MMCM_CLKOUT0_PHASE 0.000 \
  CONFIG.MMCM_CLKOUT1_DIVIDE 7 \
  CONFIG.MMCM_DIVCLK_DIVIDE 1 \
  CONFIG.NUM_OUT_CLKS 2 \
  CONFIG.PRIM_SOURCE No_buffer \
  CONFIG.USE_LOCKED false \
  CONFIG.USE_RESET false \
] [get_bd_cells pll_bank11]
create_bd_cell -type ip -vlnv xilinx.com:ip:clk_wiz:6.0 pll_bank12
set_property -dict [list \
  CONFIG.CLKIN1_JITTER_PS 149.99 \
  CONFIG.CLKOUT1_DRIVES BUFH \
  CONFIG.CLKOUT1_JITTER 93.983 \
  CONFIG.CLKOUT1_PHASE_ERROR 113.762 \
  CONFIG.CLKOUT1_REQUESTED_OUT_FREQ 133.333 \
  CONFIG.CLKOUT2_JITTER 119.459 \
  CONFIG.CLKOUT2_PHASE_ERROR 100.585 \
  CONFIG.CLKOUT2_REQUESTED_OUT_FREQ 100.000 \
  CONFIG.CLKOUT2_USED false \
  CONFIG.FEEDBACK_SOURCE FDBK_AUTO \
  CONFIG.JITTER_SEL Min_O_Jitter \
  CONFIG.MMCM_BANDWIDTH HIGH \
  CONFIG.MMCM_CLKFBOUT_MULT_F 23.750 \
  CONFIG.MMCM_CLKIN1_PERIOD 15.000 \
  CONFIG.MMCM_CLKIN2_PERIOD 10.0 \
  CONFIG.MMCM_CLKOUT0_DIVIDE_F 11.875 \
  CONFIG.MMCM_CLKOUT1_DIVIDE 1 \
  CONFIG.MMCM_DIVCLK_DIVIDE 1 \
  CONFIG.NUM_OUT_CLKS 1 \
  CONFIG.PRIM_SOURCE No_buffer \
  CONFIG.USE_LOCKED false \
  CONFIG.USE_RESET false \
] [get_bd_cells pll_bank12]
create_bd_cell -type ip -vlnv xilinx.com:ip:clk_wiz:6.0 pll_bank13
set_property -dict [list \
  CONFIG.CLKIN1_JITTER_PS 149.99 \
  CONFIG.CLKOUT1_DRIVES BUFH \
  CONFIG.CLKOUT1_JITTER 135.777 \
  CONFIG.CLKOUT1_PHASE_ERROR 107.401 \
  CONFIG.CLKOUT1_REQUESTED_OUT_FREQ 133.333 \
  CONFIG.CLKOUT2_JITTER 119.459 \
  CONFIG.CLKOUT2_PHASE_ERROR 100.585 \
  CONFIG.CLKOUT2_REQUESTED_OUT_FREQ 100.000 \
  CONFIG.CLKOUT2_USED false \
  CONFIG.FEEDBACK_SOURCE FDBK_AUTO \
  CONFIG.MMCM_CLKFBOUT_MULT_F 15.000 \
  CONFIG.MMCM_CLKIN1_PERIOD 15.000 \
  CONFIG.MMCM_CLKIN2_PERIOD 10.000 \
  CONFIG.MMCM_CLKOUT0_DIVIDE_F 7.500 \
  CONFIG.MMCM_CLKOUT1_DIVIDE 1 \
  CONFIG.MMCM_DIVCLK_DIVIDE 1 \
  CONFIG.NUM_OUT_CLKS 1 \
  CONFIG.PRIM_SOURCE Global_buffer \
  CONFIG.USE_LOCKED false \
  CONFIG.USE_RESET false \
] [get_bd_cells pll_bank13]
create_bd_cell -type ip -vlnv xilinx.com:ip:axi_bram_ctrl:4.1 axi_bram_ctrl_4
set_property -dict {CONFIG.SINGLE_PORT_BRAM 1} [get_bd_cells axi_bram_ctrl_4]
create_bd_cell -type ip -vlnv xilinx.com:ip:axi_bram_ctrl:4.1 axi_bram_ctrl_5
set_property -dict {CONFIG.SINGLE_PORT_BRAM 1} [get_bd_cells axi_bram_ctrl_5]
create_bd_cell -type ip -vlnv xilinx.com:ip:axi_bram_ctrl:4.1 axi_bram_ctrl_6
set_property -dict {CONFIG.SINGLE_PORT_BRAM 1} [get_bd_cells axi_bram_ctrl_6]
create_bd_cell -type ip -vlnv xilinx.com:ip:axi_bram_ctrl:4.1 axi_bram_ctrl_7
set_property -dict {CONFIG.SINGLE_PORT_BRAM 1} [get_bd_cells axi_bram_ctrl_7]
create_bd_cell -type ip -vlnv xilinx.com:ip:clk_wiz:6.0 pll_bank33
set_property -dict [list \
  CONFIG.CLKIN1_JITTER_PS 149.99 \
  CONFIG.CLKOUT1_DRIVES BUFG \
  CONFIG.CLKOUT1_JITTER 135.777 \
  CONFIG.CLKOUT1_PHASE_ERROR 107.401 \
  CONFIG.CLKOUT1_REQUESTED_OUT_FREQ 133.333 \
  CONFIG.CLKOUT2_JITTER 126.504 \
  CONFIG.CLKOUT2_PHASE_ERROR 107.401 \
  CONFIG.CLKOUT2_REQUESTED_OUT_FREQ 200 \
  CONFIG.CLKOUT2_USED true \
  CONFIG.FEEDBACK_SOURCE FDBK_AUTO \
  CONFIG.MMCM_CLKFBOUT_MULT_F 15.000 \
  CONFIG.MMCM_CLKIN1_PERIOD 15.000 \
  CONFIG.MMCM_CLKIN2_PERIOD 10.000 \
  CONFIG.MMCM_CLKOUT0_DIVIDE_F 7.500 \
  CONFIG.MMCM_CLKOUT1_DIVIDE 5 \
  CONFIG.MMCM_DIVCLK_DIVIDE 1 \
  CONFIG.NUM_OUT_CLKS 2 \
  CONFIG.PRIM_SOURCE No_buffer \
  CONFIG.USE_LOCKED false \
  CONFIG.USE_RESET false \
] [get_bd_cells pll_bank33]
create_bd_cell -type ip -vlnv xilinx.com:ip:clk_wiz:6.0 pll_bank34
set_property -dict [list \
  CONFIG.CLKIN1_JITTER_PS 149.99 \
  CONFIG.CLKOUT1_DRIVES BUFG \
  CONFIG.CLKOUT1_JITTER 135.777 \
  CONFIG.CLKOUT1_PHASE_ERROR 107.401 \
  CONFIG.CLKOUT1_REQUESTED_OUT_FREQ 133.333 \
  CONFIG.CLKOUT2_JITTER 119.459 \
  CONFIG.CLKOUT2_PHASE_ERROR 100.585 \
  CONFIG.CLKOUT2_REQUESTED_OUT_FREQ 100.000 \
  CONFIG.CLKOUT2_USED false \
  CONFIG.FEEDBACK_SOURCE FDBK_AUTO \
  CONFIG.MMCM_CLKFBOUT_MULT_F 15.000 \
  CONFIG.MMCM_CLKIN1_PERIOD 15.000 \
  CONFIG.MMCM_CLKIN2_PERIOD 10.000 \
  CONFIG.MMCM_CLKOUT0_DIVIDE_F 7.500 \
  CONFIG.MMCM_CLKOUT1_DIVIDE 1 \
  CONFIG.MMCM_DIVCLK_DIVIDE 1 \
  CONFIG.NUM_OUT_CLKS 1 \
  CONFIG.PRIM_SOURCE No_buffer \
  CONFIG.USE_LOCKED false \
  CONFIG.USE_RESET false \
] [get_bd_cells pll_bank34]
create_bd_cell -type ip -vlnv xilinx.com:ip:clk_wiz:6.0 pll_bank35
set_property -dict [list \
  CONFIG.CLKIN1_JITTER_PS 149.99 \
  CONFIG.CLKOUT1_DRIVES BUFH \
  CONFIG.CLKOUT1_JITTER 135.777 \
  CONFIG.CLKOUT1_PHASE_ERROR 107.401 \
  CONFIG.CLKOUT1_REQUESTED_OUT_FREQ 133.333 \
  CONFIG.CLKOUT2_JITTER 119.459 \
  CONFIG.CLKOUT2_PHASE_ERROR 100.585 \
  CONFIG.CLKOUT2_REQUESTED_OUT_FREQ 100.000 \
  CONFIG.CLKOUT2_USED false \
  CONFIG.FEEDBACK_SOURCE FDBK_AUTO \
  CONFIG.MMCM_CLKFBOUT_MULT_F 15.000 \
  CONFIG.MMCM_CLKIN1_PERIOD 15.000 \
  CONFIG.MMCM_CLKIN2_PERIOD 10.000 \
  CONFIG.MMCM_CLKOUT0_DIVIDE_F 7.500 \
  CONFIG.MMCM_CLKOUT1_DIVIDE 1 \
  CONFIG.MMCM_DIVCLK_DIVIDE 1 \
  CONFIG.NUM_OUT_CLKS 1 \
  CONFIG.PRIM_SOURCE No_buffer \
  CONFIG.USE_LOCKED false \
  CONFIG.USE_RESET false \
] [get_bd_cells pll_bank35]
create_bd_cell -type ip -vlnv xilinx.com:ip:blk_mem_gen:8.4 blk_mem_gen_4
set_property -dict [list \
  CONFIG.Assume_Synchronous_Clk true \
  CONFIG.EN_SAFETY_CKT false \
  CONFIG.Enable_32bit_Address true \
  CONFIG.Enable_B Use_ENB_Pin \
  CONFIG.Memory_Type True_Dual_Port_RAM \
  CONFIG.Port_B_Clock 100 \
  CONFIG.Port_B_Enable_Rate 100 \
  CONFIG.Port_B_Write_Rate 50 \
  CONFIG.Register_PortA_Output_of_Memory_Primitives false \
  CONFIG.Register_PortB_Output_of_Memory_Primitives false \
  CONFIG.Use_RSTA_Pin true \
  CONFIG.Use_RSTB_Pin true \
  CONFIG.Write_Depth_A 2048 \
  CONFIG.use_bram_block Stand_Alone \
] [get_bd_cells blk_mem_gen_4]
create_bd_cell -type ip -vlnv xilinx.com:ip:blk_mem_gen:8.4 blk_mem_gen_5
set_property -dict [list \
  CONFIG.Assume_Synchronous_Clk true \
  CONFIG.EN_SAFETY_CKT false \
  CONFIG.Enable_32bit_Address true \
  CONFIG.Enable_B Use_ENB_Pin \
  CONFIG.Memory_Type True_Dual_Port_RAM \
  CONFIG.Port_B_Clock 100 \
  CONFIG.Port_B_Enable_Rate 100 \
  CONFIG.Port_B_Write_Rate 50 \
  CONFIG.Register_PortA_Output_of_Memory_Primitives false \
  CONFIG.Register_PortB_Output_of_Memory_Primitives false \
  CONFIG.Use_RSTA_Pin true \
  CONFIG.Use_RSTB_Pin true \
  CONFIG.Write_Depth_A 2048 \
  CONFIG.use_bram_block Stand_Alone \
] [get_bd_cells blk_mem_gen_5]
create_bd_cell -type ip -vlnv xilinx.com:ip:blk_mem_gen:8.4 blk_mem_gen_6
set_property -dict [list \
  CONFIG.Assume_Synchronous_Clk true \
  CONFIG.EN_SAFETY_CKT false \
  CONFIG.Enable_32bit_Address true \
  CONFIG.Enable_B Use_ENB_Pin \
  CONFIG.Memory_Type True_Dual_Port_RAM \
  CONFIG.Port_B_Clock 100 \
  CONFIG.Port_B_Enable_Rate 100 \
  CONFIG.Port_B_Write_Rate 50 \
  CONFIG.Register_PortA_Output_of_Memory_Primitives false \
  CONFIG.Register_PortB_Output_of_Memory_Primitives false \
  CONFIG.Use_RSTA_Pin true \
  CONFIG.Use_RSTB_Pin true \
  CONFIG.Write_Depth_A 2048 \
  CONFIG.use_bram_block Stand_Alone \
] [get_bd_cells blk_mem_gen_6]
create_bd_cell -type ip -vlnv xilinx.com:ip:blk_mem_gen:8.4 blk_mem_gen_7
set_property -dict [list \
  CONFIG.Assume_Synchronous_Clk true \
  CONFIG.EN_SAFETY_CKT false \
  CONFIG.Enable_32bit_Address true \
  CONFIG.Enable_B Use_ENB_Pin \
  CONFIG.Memory_Type True_Dual_Port_RAM \
  CONFIG.Port_B_Clock 100 \
  CONFIG.Port_B_Enable_Rate 100 \
  CONFIG.Port_B_Write_Rate 50 \
  CONFIG.Register_PortA_Output_of_Memory_Primitives false \
  CONFIG.Register_PortB_Output_of_Memory_Primitives false \
  CONFIG.Use_RSTA_Pin true \
  CONFIG.Use_RSTB_Pin true \
  CONFIG.Write_Depth_A 2048 \
  CONFIG.use_bram_block Stand_Alone \
] [get_bd_cells blk_mem_gen_7]
create_bd_cell -type ip -vlnv xilinx.com:ip:axi_interconnect:2.1 gpic_0
set_property -dict {CONFIG.ENABLE_ADVANCED_OPTIONS 0 CONFIG.S00_HAS_DATA_FIFO 2 CONFIG.STRATEGY 2} [get_bd_cells gpic_0]
create_bd_cell -type ip -vlnv xilinx.com:ip:xlconcat:2.1 xlconcat_0
set_property -dict {CONFIG.NUM_PORTS 1 CONFIG.dout_width 1} [get_bd_cells xlconcat_0]
create_bd_cell -type ip -vlnv enclab:user:bch_skes_256B_21B_13b:1.0.2 bch_skes_256B_21B_13b_0
create_bd_cell -type ip -vlnv enclab:user:bch_skes_256B_21B_13b:1.0.2 bch_skes_256B_21B_13b_1
create_bd_cell -type ip -vlnv enclab:user:bch_sccs_256B_21B_13b:1.0.0 bch_sccs_256B_21B_13b_0
create_bd_cell -type ip -vlnv enclab:user:bch_sccs_256B_21B_13b:1.0.0 bch_sccs_256B_21B_13b_1
create_bd_cell -type ip -vlnv enclab:user:bch_sccs_256B_21B_13b:1.0.0 bch_sccs_256B_21B_13b_2
create_bd_cell -type ip -vlnv enclab:user:bch_sccs_256B_21B_13b:1.0.0 bch_sccs_256B_21B_13b_3
create_bd_cell -type ip -vlnv enclab:user:bch_sccs_256B_21B_13b:1.0.0 bch_sccs_256B_21B_13b_4
create_bd_cell -type ip -vlnv enclab:user:bch_sccs_256B_21B_13b:1.0.0 bch_sccs_256B_21B_13b_5
create_bd_cell -type ip -vlnv enclab:user:bch_sccs_256B_21B_13b:1.0.0 bch_sccs_256B_21B_13b_6
create_bd_cell -type ip -vlnv enclab:user:bch_sccs_256B_21B_13b:1.0.0 bch_sccs_256B_21B_13b_7
create_bd_cell -type ip -vlnv xilinx.com:ip:axi_interconnect:2.1 gpic_0_sub
set_property -dict {CONFIG.NUM_MI 4 CONFIG.S00_HAS_DATA_FIFO 2 CONFIG.STRATEGY 0} [get_bd_cells gpic_0_sub]
create_bd_cell -type ip -vlnv ENCLab:user:iodelay_if:1.0.0 iodelay_if_0
create_bd_cell -type ip -vlnv ENCLab:user:iodelay_if:1.0.0 iodelay_if_1
create_bd_cell -type ip -vlnv ENCLab:user:iodelay_if:1.0.0 iodelay_if_0_dqs
create_bd_cell -type ip -vlnv ENCLab:user:iodelay_if:1.0.0 iodelay_if_1_dqs
create_bd_cell -type ip -vlnv enclab:user:v2nfc:1.4.1 v2nfc_0
set_property -dict [list \
  CONFIG.DQIDelayInst 0 \
  CONFIG.DQIDelayValue 0 \
  CONFIG.IDelayValue 13 \
  CONFIG.InputClockBufferType 1 \
] [get_bd_cells v2nfc_0]
create_bd_cell -type ip -vlnv enclab:user:v2nfc:1.4.1 v2nfc_1
set_property -dict [list \
  CONFIG.DQIDelayInst 0 \
  CONFIG.DQIDelayValue 0 \
  CONFIG.IDelayCtrlInst 0 \
  CONFIG.IDelayValue 13 \
  CONFIG.InputClockBufferType 0 \
] [get_bd_cells v2nfc_1]
create_bd_cell -type ip -vlnv enclab:user:v2nfc:1.4.1 v2nfc_2
set_property -dict [list \
  CONFIG.DQIDelayInst 0 \
  CONFIG.DQIDelayValue 0 \
  CONFIG.IDelayValue 13 \
  CONFIG.InputClockBufferType 0 \
] [get_bd_cells v2nfc_2]
create_bd_cell -type ip -vlnv enclab:user:v2nfc:1.4.1 v2nfc_3
set_property -dict [list \
  CONFIG.DQIDelayInst 0 \
  CONFIG.DQIDelayValue 0 \
  CONFIG.IDelayValue 17 \
  CONFIG.InputClockBufferType 0 \
] [get_bd_cells v2nfc_3]
create_bd_cell -type ip -vlnv enclab:user:v2nfc:1.4.1 v2nfc_4
set_property -dict [list \
  CONFIG.DQIDelayInst 1 \
  CONFIG.DQIDelayValue 0 \
  CONFIG.IDelayValue 17 \
  CONFIG.InputClockBufferType 0 \
] [get_bd_cells v2nfc_4]
create_bd_cell -type ip -vlnv enclab:user:v2nfc:1.4.1 v2nfc_5
set_property -dict [list \
  CONFIG.DQIDelayInst 1 \
  CONFIG.DQIDelayValue 0 \
  CONFIG.IDelayCtrlInst 0 \
  CONFIG.IDelayValue 17 \
  CONFIG.InputClockBufferType 0 \
] [get_bd_cells v2nfc_5]
create_bd_cell -type ip -vlnv enclab:user:v2nfc:1.4.1 v2nfc_6
set_property -dict [list \
  CONFIG.DQIDelayInst 1 \
  CONFIG.DQIDelayValue 0 \
  CONFIG.IDelayValue 17 \
  CONFIG.InputClockBufferType 0 \
] [get_bd_cells v2nfc_6]
create_bd_cell -type ip -vlnv enclab:user:v2nfc:1.4.1 v2nfc_7
set_property -dict [list \
  CONFIG.DQIDelayInst 1 \
  CONFIG.DQIDelayValue 0 \
  CONFIG.IDelayValue 17 \
  CONFIG.InputClockBufferType 0 \
] [get_bd_cells v2nfc_7]
create_bd_cell -type ip -vlnv enclab:user:t4nfc_hlper:1.0.2 t4nfc_hlper_0
create_bd_cell -type ip -vlnv enclab:user:t4nfc_hlper:1.0.2 t4nfc_hlper_1
create_bd_cell -type ip -vlnv enclab:user:t4nfc_hlper:1.0.2 t4nfc_hlper_2
create_bd_cell -type ip -vlnv enclab:user:t4nfc_hlper:1.0.2 t4nfc_hlper_3
create_bd_cell -type ip -vlnv enclab:user:t4nfc_hlper:1.0.2 t4nfc_hlper_4
create_bd_cell -type ip -vlnv enclab:user:t4nfc_hlper:1.0.2 t4nfc_hlper_5
create_bd_cell -type ip -vlnv enclab:user:t4nfc_hlper:1.0.2 t4nfc_hlper_6
create_bd_cell -type ip -vlnv enclab:user:t4nfc_hlper:1.0.2 t4nfc_hlper_7
create_bd_cell -type ip -vlnv enclab:user:nvme_ctrl:1.1.0 nvme_ctrl_0
set_property -dict {CONFIG.C_S0_AXI_HIGHADDR 0x83C0FFFF} [get_bd_cells nvme_ctrl_0]

# ---- connections ----

connect_bd_intf_net [get_bd_intf_pins gpic_0/S00_AXI] [get_bd_intf_pins processing_system7_0/M_AXI_GP0]
connect_bd_intf_net [get_bd_intf_pins gpic_1/S00_AXI] [get_bd_intf_pins processing_system7_0/M_AXI_GP1]
connect_bd_intf_net [get_bd_intf_pins hpic_2/S00_AXI] [get_bd_intf_pins nvme_ctrl_0/m0_axi]
connect_bd_intf_net [get_bd_intf_pins hpic_0/S01_AXI] [get_bd_intf_pins t4nfc_hlper_1/nfch_data_if]
connect_bd_intf_net [get_bd_intf_pins hpic_1/S01_AXI] [get_bd_intf_pins t4nfc_hlper_5/nfch_data_if]
connect_bd_intf_net [get_bd_intf_pins hpic_0/S02_AXI] [get_bd_intf_pins t4nfc_hlper_2/nfch_data_if]
connect_bd_intf_net [get_bd_intf_pins hpic_1/S02_AXI] [get_bd_intf_pins t4nfc_hlper_6/nfch_data_if]
connect_bd_intf_net [get_bd_intf_pins hpic_0/S03_AXI] [get_bd_intf_pins t4nfc_hlper_3/nfch_data_if]
connect_bd_intf_net [get_bd_intf_pins hpic_1/S03_AXI] [get_bd_intf_pins t4nfc_hlper_7/nfch_data_if]
connect_bd_intf_net [get_bd_intf_pins blk_mem_gen_0/BRAM_PORTB] [get_bd_intf_pins axi_bram_ctrl_0/BRAM_PORTA]
connect_bd_intf_net [get_bd_intf_pins axi_bram_ctrl_1/BRAM_PORTA] [get_bd_intf_pins blk_mem_gen_1/BRAM_PORTB]
connect_bd_intf_net [get_bd_intf_pins axi_bram_ctrl_2/BRAM_PORTA] [get_bd_intf_pins blk_mem_gen_2/BRAM_PORTB]
connect_bd_intf_net [get_bd_intf_pins axi_bram_ctrl_3/BRAM_PORTA] [get_bd_intf_pins blk_mem_gen_3/BRAM_PORTB]
connect_bd_intf_net [get_bd_intf_pins blk_mem_gen_4/BRAM_PORTB] [get_bd_intf_pins axi_bram_ctrl_4/BRAM_PORTA]
connect_bd_intf_net [get_bd_intf_pins blk_mem_gen_5/BRAM_PORTB] [get_bd_intf_pins axi_bram_ctrl_5/BRAM_PORTA]
connect_bd_intf_net [get_bd_intf_pins axi_bram_ctrl_6/BRAM_PORTA] [get_bd_intf_pins blk_mem_gen_6/BRAM_PORTB]
connect_bd_intf_net [get_bd_intf_pins axi_bram_ctrl_7/BRAM_PORTA] [get_bd_intf_pins blk_mem_gen_7/BRAM_PORTB]
connect_bd_intf_net [get_bd_intf_ports user_led] [get_bd_intf_pins axi_gpio_0/GPIO]
connect_bd_intf_net [get_bd_intf_ports user_sw] [get_bd_intf_pins axi_gpio_0/GPIO2]
connect_bd_intf_net -intf_net axi_interconnect_0_M00_AXI [get_bd_intf_pins gpic_0/M00_AXI] [get_bd_intf_pins gpic_0_sub_0/S00_AXI]
connect_bd_intf_net -intf_net axi_interconnect_0_M01_AXI [get_bd_intf_pins gpic_0/M01_AXI] [get_bd_intf_pins gpic_0_sub_1/S00_AXI]
connect_bd_intf_net [get_bd_intf_pins bch_sccs_256B_21B_13b_0/bch_skes_if] [get_bd_intf_pins bch_skes_256B_21B_13b_0/bch_skes_ch0_if]
connect_bd_intf_net [get_bd_intf_pins bch_sccs_256B_21B_13b_0/from_ecc_if] [get_bd_intf_pins t4nfc_hlper_0/from_ecc_if]
connect_bd_intf_net [get_bd_intf_pins bch_sccs_256B_21B_13b_1/bch_skes_if] [get_bd_intf_pins bch_skes_256B_21B_13b_0/bch_skes_ch1_if]
connect_bd_intf_net [get_bd_intf_pins bch_sccs_256B_21B_13b_1/from_ecc_if] [get_bd_intf_pins t4nfc_hlper_1/from_ecc_if]
connect_bd_intf_net [get_bd_intf_pins bch_sccs_256B_21B_13b_2/bch_skes_if] [get_bd_intf_pins bch_skes_256B_21B_13b_0/bch_skes_ch2_if]
connect_bd_intf_net [get_bd_intf_pins t4nfc_hlper_2/from_ecc_if] [get_bd_intf_pins bch_sccs_256B_21B_13b_2/from_ecc_if]
connect_bd_intf_net [get_bd_intf_pins bch_sccs_256B_21B_13b_3/bch_skes_if] [get_bd_intf_pins bch_skes_256B_21B_13b_0/bch_skes_ch3_if]
connect_bd_intf_net [get_bd_intf_pins t4nfc_hlper_3/from_ecc_if] [get_bd_intf_pins bch_sccs_256B_21B_13b_3/from_ecc_if]
connect_bd_intf_net [get_bd_intf_pins bch_skes_256B_21B_13b_1/bch_skes_ch0_if] [get_bd_intf_pins bch_sccs_256B_21B_13b_4/bch_skes_if]
connect_bd_intf_net [get_bd_intf_pins t4nfc_hlper_4/from_ecc_if] [get_bd_intf_pins bch_sccs_256B_21B_13b_4/from_ecc_if]
connect_bd_intf_net [get_bd_intf_pins bch_skes_256B_21B_13b_1/bch_skes_ch1_if] [get_bd_intf_pins bch_sccs_256B_21B_13b_5/bch_skes_if]
connect_bd_intf_net [get_bd_intf_pins bch_sccs_256B_21B_13b_5/from_ecc_if] [get_bd_intf_pins t4nfc_hlper_5/from_ecc_if]
connect_bd_intf_net [get_bd_intf_pins bch_skes_256B_21B_13b_1/bch_skes_ch2_if] [get_bd_intf_pins bch_sccs_256B_21B_13b_6/bch_skes_if]
connect_bd_intf_net [get_bd_intf_pins bch_sccs_256B_21B_13b_6/from_ecc_if] [get_bd_intf_pins t4nfc_hlper_6/from_ecc_if]
connect_bd_intf_net [get_bd_intf_pins bch_sccs_256B_21B_13b_7/bch_skes_if] [get_bd_intf_pins bch_skes_256B_21B_13b_1/bch_skes_ch3_if]
connect_bd_intf_net [get_bd_intf_pins bch_sccs_256B_21B_13b_7/from_ecc_if] [get_bd_intf_pins t4nfc_hlper_7/from_ecc_if]
connect_bd_intf_net -intf_net gpic_0_M01_AXI [get_bd_intf_pins gpic_0_sub_0/M01_AXI] [get_bd_intf_pins axi_bram_ctrl_0/S_AXI]
connect_bd_intf_net -intf_net gpic_0_M03_AXI [get_bd_intf_pins gpic_0_sub_0/M03_AXI] [get_bd_intf_pins axi_bram_ctrl_1/S_AXI]
connect_bd_intf_net -intf_net gpic_0_M05_AXI [get_bd_intf_pins gpic_0_sub_0/M05_AXI] [get_bd_intf_pins axi_bram_ctrl_2/S_AXI]
connect_bd_intf_net -intf_net gpic_0_M07_AXI [get_bd_intf_pins gpic_0_sub_0/M07_AXI] [get_bd_intf_pins axi_bram_ctrl_3/S_AXI]
connect_bd_intf_net [get_bd_intf_pins t4nfc_hlper_0/nfch_cmd_if] [get_bd_intf_pins gpic_0_sub_0/M00_AXI]
connect_bd_intf_net [get_bd_intf_pins t4nfc_hlper_1/nfch_cmd_if] [get_bd_intf_pins gpic_0_sub_0/M02_AXI]
connect_bd_intf_net [get_bd_intf_pins t4nfc_hlper_2/nfch_cmd_if] [get_bd_intf_pins gpic_0_sub_0/M04_AXI]
connect_bd_intf_net [get_bd_intf_pins gpic_0_sub_0/M06_AXI] [get_bd_intf_pins t4nfc_hlper_3/nfch_cmd_if]
connect_bd_intf_net [get_bd_intf_pins t4nfc_hlper_4/nfch_cmd_if] [get_bd_intf_pins gpic_0_sub_1/M00_AXI]
connect_bd_intf_net [get_bd_intf_pins gpic_0_sub_1/M02_AXI] [get_bd_intf_pins t4nfc_hlper_5/nfch_cmd_if]
connect_bd_intf_net [get_bd_intf_pins gpic_0_sub_1/M04_AXI] [get_bd_intf_pins t4nfc_hlper_6/nfch_cmd_if]
connect_bd_intf_net [get_bd_intf_pins gpic_0_sub_1/M06_AXI] [get_bd_intf_pins t4nfc_hlper_7/nfch_cmd_if]
connect_bd_intf_net [get_bd_intf_pins gpic_0_sub/M00_AXI] [get_bd_intf_pins iodelay_if_0/ctrl__s]
connect_bd_intf_net [get_bd_intf_pins gpic_0_sub/M01_AXI] [get_bd_intf_pins iodelay_if_1/ctrl__s]
connect_bd_intf_net [get_bd_intf_pins gpic_0_sub/M02_AXI] [get_bd_intf_pins iodelay_if_0_dqs/ctrl__s]
connect_bd_intf_net [get_bd_intf_pins gpic_0_sub/M03_AXI] [get_bd_intf_pins iodelay_if_1_dqs/ctrl__s]
connect_bd_intf_net [get_bd_intf_pins nvme_ctrl_0/s0_axi] [get_bd_intf_pins gpic_1/M00_AXI]
connect_bd_intf_net -intf_net gpic_1_M01_AXI [get_bd_intf_pins gpic_0_sub_1/M01_AXI] [get_bd_intf_pins axi_bram_ctrl_4/S_AXI]
connect_bd_intf_net [get_bd_intf_pins gpic_1/M02_AXI] [get_bd_intf_pins gpic_0_sub/S00_AXI]
connect_bd_intf_net -intf_net gpic_1_M03_AXI [get_bd_intf_pins gpic_0_sub_1/M03_AXI] [get_bd_intf_pins axi_bram_ctrl_5/S_AXI]
connect_bd_intf_net -intf_net gpic_1_M05_AXI [get_bd_intf_pins gpic_0_sub_1/M05_AXI] [get_bd_intf_pins axi_bram_ctrl_6/S_AXI]
connect_bd_intf_net -intf_net gpic_1_M07_AXI [get_bd_intf_pins gpic_0_sub_1/M07_AXI] [get_bd_intf_pins axi_bram_ctrl_7/S_AXI]
connect_bd_intf_net -intf_net gpic_2_M01_AXI [get_bd_intf_pins axi_gpio_0/S_AXI] [get_bd_intf_pins gpic_1/M01_AXI]
connect_bd_intf_net [get_bd_intf_pins processing_system7_0/S_AXI_HP0] [get_bd_intf_pins hpic_0/M00_AXI]
connect_bd_intf_net [get_bd_intf_pins processing_system7_0/S_AXI_HP1] [get_bd_intf_pins hpic_1/M00_AXI]
connect_bd_intf_net [get_bd_intf_pins hpic_2/M00_AXI] [get_bd_intf_pins processing_system7_0/S_AXI_HP2]
connect_bd_intf_net [get_bd_intf_ports pcie_lane] [get_bd_intf_pins nvme_ctrl_0/pcie_lane]
connect_bd_intf_net -intf_net pcie_ref_clk_0_1 [get_bd_intf_ports pcie_ref_clk] [get_bd_intf_pins nvme_ctrl_0/pcie_ref_clk]
connect_bd_intf_net [get_bd_intf_ports DDR] [get_bd_intf_pins processing_system7_0/DDR]
connect_bd_intf_net [get_bd_intf_ports FIXED_IO] [get_bd_intf_pins processing_system7_0/FIXED_IO]
connect_bd_intf_net [get_bd_intf_pins t4nfc_hlper_0/nfch_data_if] [get_bd_intf_pins hpic_0/S00_AXI]
connect_bd_intf_net [get_bd_intf_pins bch_sccs_256B_21B_13b_0/to_ecc_if] [get_bd_intf_pins t4nfc_hlper_0/to_ecc_if]
connect_bd_intf_net [get_bd_intf_pins t4nfc_hlper_0/ucode_if] [get_bd_intf_pins blk_mem_gen_0/BRAM_PORTA]
connect_bd_intf_net [get_bd_intf_pins t4nfc_hlper_0/v2nfc_if] [get_bd_intf_pins v2nfc_0/v2nfc_if]
connect_bd_intf_net [get_bd_intf_pins bch_sccs_256B_21B_13b_1/to_ecc_if] [get_bd_intf_pins t4nfc_hlper_1/to_ecc_if]
connect_bd_intf_net [get_bd_intf_pins blk_mem_gen_1/BRAM_PORTA] [get_bd_intf_pins t4nfc_hlper_1/ucode_if]
connect_bd_intf_net [get_bd_intf_pins t4nfc_hlper_1/v2nfc_if] [get_bd_intf_pins v2nfc_1/v2nfc_if]
connect_bd_intf_net [get_bd_intf_pins t4nfc_hlper_2/to_ecc_if] [get_bd_intf_pins bch_sccs_256B_21B_13b_2/to_ecc_if]
connect_bd_intf_net [get_bd_intf_pins t4nfc_hlper_2/ucode_if] [get_bd_intf_pins blk_mem_gen_2/BRAM_PORTA]
connect_bd_intf_net [get_bd_intf_pins t4nfc_hlper_2/v2nfc_if] [get_bd_intf_pins v2nfc_2/v2nfc_if]
connect_bd_intf_net [get_bd_intf_pins t4nfc_hlper_3/to_ecc_if] [get_bd_intf_pins bch_sccs_256B_21B_13b_3/to_ecc_if]
connect_bd_intf_net [get_bd_intf_pins blk_mem_gen_3/BRAM_PORTA] [get_bd_intf_pins t4nfc_hlper_3/ucode_if]
connect_bd_intf_net [get_bd_intf_pins t4nfc_hlper_3/v2nfc_if] [get_bd_intf_pins v2nfc_3/v2nfc_if]
connect_bd_intf_net [get_bd_intf_pins t4nfc_hlper_4/nfch_data_if] [get_bd_intf_pins hpic_1/S00_AXI]
connect_bd_intf_net [get_bd_intf_pins t4nfc_hlper_4/to_ecc_if] [get_bd_intf_pins bch_sccs_256B_21B_13b_4/to_ecc_if]
connect_bd_intf_net [get_bd_intf_pins blk_mem_gen_4/BRAM_PORTA] [get_bd_intf_pins t4nfc_hlper_4/ucode_if]
connect_bd_intf_net [get_bd_intf_pins v2nfc_4/v2nfc_if] [get_bd_intf_pins t4nfc_hlper_4/v2nfc_if]
connect_bd_intf_net [get_bd_intf_pins t4nfc_hlper_5/to_ecc_if] [get_bd_intf_pins bch_sccs_256B_21B_13b_5/to_ecc_if]
connect_bd_intf_net [get_bd_intf_pins blk_mem_gen_5/BRAM_PORTA] [get_bd_intf_pins t4nfc_hlper_5/ucode_if]
connect_bd_intf_net [get_bd_intf_pins t4nfc_hlper_5/v2nfc_if] [get_bd_intf_pins v2nfc_5/v2nfc_if]
connect_bd_intf_net [get_bd_intf_pins t4nfc_hlper_6/to_ecc_if] [get_bd_intf_pins bch_sccs_256B_21B_13b_6/to_ecc_if]
connect_bd_intf_net [get_bd_intf_pins blk_mem_gen_6/BRAM_PORTA] [get_bd_intf_pins t4nfc_hlper_6/ucode_if]
connect_bd_intf_net [get_bd_intf_pins v2nfc_6/v2nfc_if] [get_bd_intf_pins t4nfc_hlper_6/v2nfc_if]
connect_bd_intf_net [get_bd_intf_pins t4nfc_hlper_7/to_ecc_if] [get_bd_intf_pins bch_sccs_256B_21B_13b_7/to_ecc_if]
connect_bd_intf_net [get_bd_intf_pins blk_mem_gen_7/BRAM_PORTA] [get_bd_intf_pins t4nfc_hlper_7/ucode_if]
connect_bd_intf_net [get_bd_intf_pins t4nfc_hlper_7/v2nfc_if] [get_bd_intf_pins v2nfc_7/v2nfc_if]
connect_bd_intf_net [get_bd_intf_ports nand_if_0] [get_bd_intf_pins v2nfc_0/nand_if]
connect_bd_intf_net [get_bd_intf_ports nand_if_1] [get_bd_intf_pins v2nfc_1/nand_if]
connect_bd_intf_net [get_bd_intf_ports nand_if_2] [get_bd_intf_pins v2nfc_2/nand_if]
connect_bd_intf_net [get_bd_intf_ports nand_if_3] [get_bd_intf_pins v2nfc_3/nand_if]
connect_bd_intf_net [get_bd_intf_ports nand_if_4] [get_bd_intf_pins v2nfc_4/nand_if]
connect_bd_intf_net [get_bd_intf_ports nand_if_5] [get_bd_intf_pins v2nfc_5/nand_if]
connect_bd_intf_net [get_bd_intf_ports nand_if_6] [get_bd_intf_pins v2nfc_6/nand_if]
connect_bd_intf_net [get_bd_intf_ports nand_if_7] [get_bd_intf_pins v2nfc_7/nand_if]
connect_bd_net -net ARESETN_1 [get_bd_pins proc_sys_reset_0/interconnect_aresetn] [get_bd_pins gpic_0_sub_0/ARESETN]
connect_bd_net -net M00_ARESETN_1 [get_bd_pins proc_sys_reset_2/peripheral_aresetn] \
  [get_bd_pins axi_gpio_0/s_axi_aresetn] [get_bd_pins gpic_0/S00_ARESETN] [get_bd_pins gpic_1/S00_ARESETN] \
  [get_bd_pins gpic_1/M00_ARESETN] [get_bd_pins gpic_1/M01_ARESETN] [get_bd_pins gpic_1/M02_ARESETN] \
  [get_bd_pins gpic_0_sub/S00_ARESETN] [get_bd_pins hpic_0/M00_ARESETN] [get_bd_pins hpic_1/M00_ARESETN] \
  [get_bd_pins nvme_ctrl_0/s0_axi_aresetn]
connect_bd_net -net S00_ARESETN_1 [get_bd_pins proc_sys_reset_0/peripheral_aresetn] \
  [get_bd_pins iodelay_if_0/sys__srstn] [get_bd_pins iodelay_if_0_dqs/sys__srstn] [get_bd_pins axi_bram_ctrl_0/s_axi_aresetn] \
  [get_bd_pins axi_bram_ctrl_1/s_axi_aresetn] [get_bd_pins axi_bram_ctrl_2/s_axi_aresetn] \
  [get_bd_pins axi_bram_ctrl_3/s_axi_aresetn] [get_bd_pins gpic_0/M00_ARESETN] [get_bd_pins gpic_0_sub_0/S00_ARESETN] \
  [get_bd_pins gpic_0_sub_0/M00_ARESETN] [get_bd_pins gpic_0_sub_0/M01_ARESETN] [get_bd_pins gpic_0_sub_0/M02_ARESETN] \
  [get_bd_pins gpic_0_sub_0/M03_ARESETN] [get_bd_pins gpic_0_sub_0/M04_ARESETN] [get_bd_pins gpic_0_sub_0/M05_ARESETN] \
  [get_bd_pins gpic_0_sub_0/M06_ARESETN] [get_bd_pins gpic_0_sub_0/M07_ARESETN] [get_bd_pins gpic_0_sub/M00_ARESETN] \
  [get_bd_pins gpic_0_sub/M02_ARESETN] [get_bd_pins hpic_0/S00_ARESETN] [get_bd_pins hpic_0/S01_ARESETN] \
  [get_bd_pins hpic_0/S02_ARESETN] [get_bd_pins hpic_0/S03_ARESETN]
connect_bd_net -net S00_ARESETN_2 [get_bd_pins proc_sys_reset_1/peripheral_aresetn] \
  [get_bd_pins iodelay_if_1/sys__srstn] [get_bd_pins iodelay_if_1_dqs/sys__srstn] [get_bd_pins axi_bram_ctrl_4/s_axi_aresetn] \
  [get_bd_pins axi_bram_ctrl_5/s_axi_aresetn] [get_bd_pins axi_bram_ctrl_6/s_axi_aresetn] \
  [get_bd_pins axi_bram_ctrl_7/s_axi_aresetn] [get_bd_pins gpic_0/M01_ARESETN] [get_bd_pins gpic_0_sub_1/S00_ARESETN] \
  [get_bd_pins gpic_0_sub_1/M00_ARESETN] [get_bd_pins gpic_0_sub_1/M01_ARESETN] [get_bd_pins gpic_0_sub_1/M02_ARESETN] \
  [get_bd_pins gpic_0_sub_1/M03_ARESETN] [get_bd_pins gpic_0_sub_1/M04_ARESETN] [get_bd_pins gpic_0_sub_1/M05_ARESETN] \
  [get_bd_pins gpic_0_sub_1/M06_ARESETN] [get_bd_pins gpic_0_sub_1/M07_ARESETN] [get_bd_pins gpic_0_sub/M01_ARESETN] \
  [get_bd_pins gpic_0_sub/M03_ARESETN] [get_bd_pins hpic_1/S00_ARESETN] [get_bd_pins hpic_1/S01_ARESETN] \
  [get_bd_pins hpic_1/S02_ARESETN] [get_bd_pins hpic_1/S03_ARESETN]
connect_bd_net -net S00_ARESETN_3 [get_bd_pins proc_sys_reset_3/peripheral_aresetn] \
  [get_bd_pins hpic_2/S00_ARESETN] [get_bd_pins hpic_2/M00_ARESETN] [get_bd_pins nvme_ctrl_0/m0_axi_aresetn]
connect_bd_net [get_bd_pins iodelay_if_0_dqs/iodly_00__tap] [get_bd_pins v2nfc_0/iDQSIDelayTap]
connect_bd_net [get_bd_pins iodelay_if_0_dqs/iodly_00__tap_load] [get_bd_pins v2nfc_0/iDQSIDelayTapLoad]
connect_bd_net [get_bd_pins iodelay_if_0_dqs/iodly_01__tap] [get_bd_pins v2nfc_1/iDQSIDelayTap]
connect_bd_net [get_bd_pins iodelay_if_0_dqs/iodly_01__tap_load] [get_bd_pins v2nfc_1/iDQSIDelayTapLoad]
connect_bd_net [get_bd_pins iodelay_if_0_dqs/iodly_02__tap] [get_bd_pins v2nfc_2/iDQSIDelayTap]
connect_bd_net [get_bd_pins iodelay_if_0_dqs/iodly_02__tap_load] [get_bd_pins v2nfc_2/iDQSIDelayTapLoad]
connect_bd_net [get_bd_pins iodelay_if_0_dqs/iodly_03__tap] [get_bd_pins v2nfc_3/iDQSIDelayTap]
connect_bd_net [get_bd_pins iodelay_if_0_dqs/iodly_03__tap_load] [get_bd_pins v2nfc_3/iDQSIDelayTapLoad]
connect_bd_net [get_bd_pins iodelay_if_0/iodly_00__tap] [get_bd_pins v2nfc_0/iDQ0IDelayTap]
connect_bd_net [get_bd_pins iodelay_if_0/iodly_00__tap_load] [get_bd_pins v2nfc_0/iDQ0IDelayTapLoad]
connect_bd_net [get_bd_pins iodelay_if_0/iodly_01__tap] [get_bd_pins v2nfc_0/iDQ1IDelayTap]
connect_bd_net [get_bd_pins iodelay_if_0/iodly_01__tap_load] [get_bd_pins v2nfc_0/iDQ1IDelayTapLoad]
connect_bd_net [get_bd_pins iodelay_if_0/iodly_02__tap] [get_bd_pins v2nfc_0/iDQ2IDelayTap]
connect_bd_net [get_bd_pins iodelay_if_0/iodly_02__tap_load] [get_bd_pins v2nfc_0/iDQ2IDelayTapLoad]
connect_bd_net [get_bd_pins iodelay_if_0/iodly_03__tap] [get_bd_pins v2nfc_0/iDQ3IDelayTap]
connect_bd_net [get_bd_pins iodelay_if_0/iodly_03__tap_load] [get_bd_pins v2nfc_0/iDQ3IDelayTapLoad]
connect_bd_net [get_bd_pins iodelay_if_0/iodly_04__tap] [get_bd_pins v2nfc_0/iDQ4IDelayTap]
connect_bd_net [get_bd_pins iodelay_if_0/iodly_04__tap_load] [get_bd_pins v2nfc_0/iDQ4IDelayTapLoad]
connect_bd_net [get_bd_pins iodelay_if_0/iodly_05__tap] [get_bd_pins v2nfc_0/iDQ5IDelayTap]
connect_bd_net [get_bd_pins iodelay_if_0/iodly_05__tap_load] [get_bd_pins v2nfc_0/iDQ5IDelayTapLoad]
connect_bd_net [get_bd_pins iodelay_if_0/iodly_06__tap] [get_bd_pins v2nfc_0/iDQ6IDelayTap]
connect_bd_net [get_bd_pins iodelay_if_0/iodly_06__tap_load] [get_bd_pins v2nfc_0/iDQ6IDelayTapLoad]
connect_bd_net [get_bd_pins iodelay_if_0/iodly_07__tap] [get_bd_pins v2nfc_0/iDQ7IDelayTap]
connect_bd_net [get_bd_pins iodelay_if_0/iodly_07__tap_load] [get_bd_pins v2nfc_0/iDQ7IDelayTapLoad]
connect_bd_net [get_bd_pins iodelay_if_0/iodly_08__tap] [get_bd_pins v2nfc_1/iDQ0IDelayTap]
connect_bd_net [get_bd_pins iodelay_if_0/iodly_08__tap_load] [get_bd_pins v2nfc_1/iDQ0IDelayTapLoad]
connect_bd_net [get_bd_pins iodelay_if_0/iodly_09__tap] [get_bd_pins v2nfc_1/iDQ1IDelayTap]
connect_bd_net [get_bd_pins iodelay_if_0/iodly_09__tap_load] [get_bd_pins v2nfc_1/iDQ1IDelayTapLoad]
connect_bd_net [get_bd_pins iodelay_if_0/iodly_10__tap] [get_bd_pins v2nfc_1/iDQ2IDelayTap]
connect_bd_net [get_bd_pins iodelay_if_0/iodly_10__tap_load] [get_bd_pins v2nfc_1/iDQ2IDelayTapLoad]
connect_bd_net [get_bd_pins iodelay_if_0/iodly_11__tap] [get_bd_pins v2nfc_1/iDQ3IDelayTap]
connect_bd_net [get_bd_pins iodelay_if_0/iodly_11__tap_load] [get_bd_pins v2nfc_1/iDQ3IDelayTapLoad]
connect_bd_net [get_bd_pins iodelay_if_0/iodly_12__tap] [get_bd_pins v2nfc_1/iDQ4IDelayTap]
connect_bd_net [get_bd_pins iodelay_if_0/iodly_12__tap_load] [get_bd_pins v2nfc_1/iDQ4IDelayTapLoad]
connect_bd_net [get_bd_pins iodelay_if_0/iodly_13__tap] [get_bd_pins v2nfc_1/iDQ5IDelayTap]
connect_bd_net [get_bd_pins iodelay_if_0/iodly_13__tap_load] [get_bd_pins v2nfc_1/iDQ5IDelayTapLoad]
connect_bd_net [get_bd_pins iodelay_if_0/iodly_14__tap] [get_bd_pins v2nfc_1/iDQ6IDelayTap]
connect_bd_net [get_bd_pins iodelay_if_0/iodly_14__tap_load] [get_bd_pins v2nfc_1/iDQ6IDelayTapLoad]
connect_bd_net [get_bd_pins iodelay_if_0/iodly_15__tap] [get_bd_pins v2nfc_1/iDQ7IDelayTap]
connect_bd_net [get_bd_pins iodelay_if_0/iodly_15__tap_load] [get_bd_pins v2nfc_1/iDQ7IDelayTapLoad]
connect_bd_net [get_bd_pins iodelay_if_0/iodly_16__tap] [get_bd_pins v2nfc_2/iDQ0IDelayTap]
connect_bd_net [get_bd_pins iodelay_if_0/iodly_16__tap_load] [get_bd_pins v2nfc_2/iDQ0IDelayTapLoad]
connect_bd_net [get_bd_pins iodelay_if_0/iodly_17__tap] [get_bd_pins v2nfc_2/iDQ1IDelayTap]
connect_bd_net [get_bd_pins iodelay_if_0/iodly_17__tap_load] [get_bd_pins v2nfc_2/iDQ1IDelayTapLoad]
connect_bd_net [get_bd_pins iodelay_if_0/iodly_18__tap] [get_bd_pins v2nfc_2/iDQ2IDelayTap]
connect_bd_net [get_bd_pins iodelay_if_0/iodly_18__tap_load] [get_bd_pins v2nfc_2/iDQ2IDelayTapLoad]
connect_bd_net [get_bd_pins iodelay_if_0/iodly_19__tap] [get_bd_pins v2nfc_2/iDQ3IDelayTap]
connect_bd_net [get_bd_pins iodelay_if_0/iodly_19__tap_load] [get_bd_pins v2nfc_2/iDQ3IDelayTapLoad]
connect_bd_net [get_bd_pins iodelay_if_0/iodly_20__tap] [get_bd_pins v2nfc_2/iDQ4IDelayTap]
connect_bd_net [get_bd_pins iodelay_if_0/iodly_20__tap_load] [get_bd_pins v2nfc_2/iDQ4IDelayTapLoad]
connect_bd_net [get_bd_pins iodelay_if_0/iodly_21__tap] [get_bd_pins v2nfc_2/iDQ5IDelayTap]
connect_bd_net [get_bd_pins iodelay_if_0/iodly_21__tap_load] [get_bd_pins v2nfc_2/iDQ5IDelayTapLoad]
connect_bd_net [get_bd_pins iodelay_if_0/iodly_22__tap] [get_bd_pins v2nfc_2/iDQ6IDelayTap]
connect_bd_net [get_bd_pins iodelay_if_0/iodly_22__tap_load] [get_bd_pins v2nfc_2/iDQ6IDelayTapLoad]
connect_bd_net [get_bd_pins iodelay_if_0/iodly_23__tap] [get_bd_pins v2nfc_2/iDQ7IDelayTap]
connect_bd_net [get_bd_pins iodelay_if_0/iodly_23__tap_load] [get_bd_pins v2nfc_2/iDQ7IDelayTapLoad]
connect_bd_net [get_bd_pins iodelay_if_0/iodly_24__tap] [get_bd_pins v2nfc_3/iDQ0IDelayTap]
connect_bd_net [get_bd_pins iodelay_if_0/iodly_24__tap_load] [get_bd_pins v2nfc_3/iDQ0IDelayTapLoad]
connect_bd_net [get_bd_pins iodelay_if_0/iodly_25__tap] [get_bd_pins v2nfc_3/iDQ1IDelayTap]
connect_bd_net [get_bd_pins iodelay_if_0/iodly_25__tap_load] [get_bd_pins v2nfc_3/iDQ1IDelayTapLoad]
connect_bd_net [get_bd_pins iodelay_if_0/iodly_26__tap] [get_bd_pins v2nfc_3/iDQ2IDelayTap]
connect_bd_net [get_bd_pins iodelay_if_0/iodly_26__tap_load] [get_bd_pins v2nfc_3/iDQ2IDelayTapLoad]
connect_bd_net [get_bd_pins iodelay_if_0/iodly_27__tap] [get_bd_pins v2nfc_3/iDQ3IDelayTap]
connect_bd_net [get_bd_pins iodelay_if_0/iodly_27__tap_load] [get_bd_pins v2nfc_3/iDQ3IDelayTapLoad]
connect_bd_net [get_bd_pins iodelay_if_0/iodly_28__tap] [get_bd_pins v2nfc_3/iDQ4IDelayTap]
connect_bd_net [get_bd_pins iodelay_if_0/iodly_28__tap_load] [get_bd_pins v2nfc_3/iDQ4IDelayTapLoad]
connect_bd_net [get_bd_pins iodelay_if_0/iodly_29__tap] [get_bd_pins v2nfc_3/iDQ5IDelayTap]
connect_bd_net [get_bd_pins iodelay_if_0/iodly_29__tap_load] [get_bd_pins v2nfc_3/iDQ5IDelayTapLoad]
connect_bd_net [get_bd_pins iodelay_if_0/iodly_30__tap] [get_bd_pins v2nfc_3/iDQ6IDelayTap]
connect_bd_net [get_bd_pins iodelay_if_0/iodly_30__tap_load] [get_bd_pins v2nfc_3/iDQ6IDelayTapLoad]
connect_bd_net [get_bd_pins iodelay_if_0/iodly_31__tap] [get_bd_pins v2nfc_3/iDQ7IDelayTap]
connect_bd_net [get_bd_pins iodelay_if_0/iodly_31__tap_load] [get_bd_pins v2nfc_3/iDQ7IDelayTapLoad]
connect_bd_net [get_bd_pins iodelay_if_1_dqs/iodly_00__tap] [get_bd_pins v2nfc_4/iDQSIDelayTap]
connect_bd_net [get_bd_pins iodelay_if_1_dqs/iodly_00__tap_load] [get_bd_pins v2nfc_4/iDQSIDelayTapLoad]
connect_bd_net [get_bd_pins iodelay_if_1_dqs/iodly_01__tap] [get_bd_pins v2nfc_5/iDQSIDelayTap]
connect_bd_net [get_bd_pins iodelay_if_1_dqs/iodly_01__tap_load] [get_bd_pins v2nfc_5/iDQSIDelayTapLoad]
connect_bd_net [get_bd_pins iodelay_if_1_dqs/iodly_02__tap] [get_bd_pins v2nfc_6/iDQSIDelayTap]
connect_bd_net [get_bd_pins iodelay_if_1_dqs/iodly_02__tap_load] [get_bd_pins v2nfc_6/iDQSIDelayTapLoad]
connect_bd_net [get_bd_pins iodelay_if_1_dqs/iodly_03__tap] [get_bd_pins v2nfc_7/iDQSIDelayTap]
connect_bd_net [get_bd_pins iodelay_if_1_dqs/iodly_03__tap_load] [get_bd_pins v2nfc_7/iDQSIDelayTapLoad]
connect_bd_net [get_bd_pins iodelay_if_1/iodly_00__tap] [get_bd_pins v2nfc_4/iDQ0IDelayTap]
connect_bd_net [get_bd_pins iodelay_if_1/iodly_00__tap_load] [get_bd_pins v2nfc_4/iDQ0IDelayTapLoad]
connect_bd_net [get_bd_pins iodelay_if_1/iodly_01__tap] [get_bd_pins v2nfc_4/iDQ1IDelayTap]
connect_bd_net [get_bd_pins iodelay_if_1/iodly_01__tap_load] [get_bd_pins v2nfc_4/iDQ1IDelayTapLoad]
connect_bd_net [get_bd_pins iodelay_if_1/iodly_02__tap] [get_bd_pins v2nfc_4/iDQ2IDelayTap]
connect_bd_net [get_bd_pins iodelay_if_1/iodly_02__tap_load] [get_bd_pins v2nfc_4/iDQ2IDelayTapLoad]
connect_bd_net [get_bd_pins iodelay_if_1/iodly_03__tap] [get_bd_pins v2nfc_4/iDQ3IDelayTap]
connect_bd_net [get_bd_pins iodelay_if_1/iodly_03__tap_load] [get_bd_pins v2nfc_4/iDQ3IDelayTapLoad]
connect_bd_net [get_bd_pins iodelay_if_1/iodly_04__tap] [get_bd_pins v2nfc_4/iDQ4IDelayTap]
connect_bd_net [get_bd_pins iodelay_if_1/iodly_04__tap_load] [get_bd_pins v2nfc_4/iDQ4IDelayTapLoad]
connect_bd_net [get_bd_pins iodelay_if_1/iodly_05__tap] [get_bd_pins v2nfc_4/iDQ5IDelayTap]
connect_bd_net [get_bd_pins iodelay_if_1/iodly_05__tap_load] [get_bd_pins v2nfc_4/iDQ5IDelayTapLoad]
connect_bd_net [get_bd_pins iodelay_if_1/iodly_06__tap] [get_bd_pins v2nfc_4/iDQ6IDelayTap]
connect_bd_net [get_bd_pins iodelay_if_1/iodly_06__tap_load] [get_bd_pins v2nfc_4/iDQ6IDelayTapLoad]
connect_bd_net [get_bd_pins iodelay_if_1/iodly_07__tap] [get_bd_pins v2nfc_4/iDQ7IDelayTap]
connect_bd_net [get_bd_pins iodelay_if_1/iodly_07__tap_load] [get_bd_pins v2nfc_4/iDQ7IDelayTapLoad]
connect_bd_net [get_bd_pins iodelay_if_1/iodly_08__tap] [get_bd_pins v2nfc_5/iDQ0IDelayTap]
connect_bd_net [get_bd_pins iodelay_if_1/iodly_08__tap_load] [get_bd_pins v2nfc_5/iDQ0IDelayTapLoad]
connect_bd_net [get_bd_pins iodelay_if_1/iodly_09__tap] [get_bd_pins v2nfc_5/iDQ1IDelayTap]
connect_bd_net [get_bd_pins iodelay_if_1/iodly_09__tap_load] [get_bd_pins v2nfc_5/iDQ1IDelayTapLoad]
connect_bd_net [get_bd_pins iodelay_if_1/iodly_10__tap] [get_bd_pins v2nfc_5/iDQ2IDelayTap]
connect_bd_net [get_bd_pins iodelay_if_1/iodly_10__tap_load] [get_bd_pins v2nfc_5/iDQ2IDelayTapLoad]
connect_bd_net [get_bd_pins iodelay_if_1/iodly_11__tap] [get_bd_pins v2nfc_5/iDQ3IDelayTap]
connect_bd_net [get_bd_pins iodelay_if_1/iodly_11__tap_load] [get_bd_pins v2nfc_5/iDQ3IDelayTapLoad]
connect_bd_net [get_bd_pins iodelay_if_1/iodly_12__tap] [get_bd_pins v2nfc_5/iDQ4IDelayTap]
connect_bd_net [get_bd_pins iodelay_if_1/iodly_12__tap_load] [get_bd_pins v2nfc_5/iDQ4IDelayTapLoad]
connect_bd_net [get_bd_pins iodelay_if_1/iodly_13__tap] [get_bd_pins v2nfc_5/iDQ5IDelayTap]
connect_bd_net [get_bd_pins iodelay_if_1/iodly_13__tap_load] [get_bd_pins v2nfc_5/iDQ5IDelayTapLoad]
connect_bd_net [get_bd_pins iodelay_if_1/iodly_14__tap] [get_bd_pins v2nfc_5/iDQ6IDelayTap]
connect_bd_net [get_bd_pins iodelay_if_1/iodly_14__tap_load] [get_bd_pins v2nfc_5/iDQ6IDelayTapLoad]
connect_bd_net [get_bd_pins iodelay_if_1/iodly_15__tap] [get_bd_pins v2nfc_5/iDQ7IDelayTap]
connect_bd_net [get_bd_pins iodelay_if_1/iodly_15__tap_load] [get_bd_pins v2nfc_5/iDQ7IDelayTapLoad]
connect_bd_net [get_bd_pins iodelay_if_1/iodly_16__tap] [get_bd_pins v2nfc_6/iDQ0IDelayTap]
connect_bd_net [get_bd_pins iodelay_if_1/iodly_16__tap_load] [get_bd_pins v2nfc_6/iDQ0IDelayTapLoad]
connect_bd_net [get_bd_pins iodelay_if_1/iodly_17__tap] [get_bd_pins v2nfc_6/iDQ1IDelayTap]
connect_bd_net [get_bd_pins iodelay_if_1/iodly_17__tap_load] [get_bd_pins v2nfc_6/iDQ1IDelayTapLoad]
connect_bd_net [get_bd_pins iodelay_if_1/iodly_18__tap] [get_bd_pins v2nfc_6/iDQ2IDelayTap]
connect_bd_net [get_bd_pins iodelay_if_1/iodly_18__tap_load] [get_bd_pins v2nfc_6/iDQ2IDelayTapLoad]
connect_bd_net [get_bd_pins iodelay_if_1/iodly_19__tap] [get_bd_pins v2nfc_6/iDQ3IDelayTap]
connect_bd_net [get_bd_pins iodelay_if_1/iodly_19__tap_load] [get_bd_pins v2nfc_6/iDQ3IDelayTapLoad]
connect_bd_net [get_bd_pins iodelay_if_1/iodly_20__tap] [get_bd_pins v2nfc_6/iDQ4IDelayTap]
connect_bd_net [get_bd_pins iodelay_if_1/iodly_20__tap_load] [get_bd_pins v2nfc_6/iDQ4IDelayTapLoad]
connect_bd_net [get_bd_pins iodelay_if_1/iodly_21__tap] [get_bd_pins v2nfc_6/iDQ5IDelayTap]
connect_bd_net [get_bd_pins iodelay_if_1/iodly_21__tap_load] [get_bd_pins v2nfc_6/iDQ5IDelayTapLoad]
connect_bd_net [get_bd_pins iodelay_if_1/iodly_22__tap] [get_bd_pins v2nfc_6/iDQ6IDelayTap]
connect_bd_net [get_bd_pins iodelay_if_1/iodly_22__tap_load] [get_bd_pins v2nfc_6/iDQ6IDelayTapLoad]
connect_bd_net [get_bd_pins iodelay_if_1/iodly_23__tap] [get_bd_pins v2nfc_6/iDQ7IDelayTap]
connect_bd_net [get_bd_pins iodelay_if_1/iodly_23__tap_load] [get_bd_pins v2nfc_6/iDQ7IDelayTapLoad]
connect_bd_net [get_bd_pins iodelay_if_1/iodly_24__tap] [get_bd_pins v2nfc_7/iDQ0IDelayTap]
connect_bd_net [get_bd_pins iodelay_if_1/iodly_24__tap_load] [get_bd_pins v2nfc_7/iDQ0IDelayTapLoad]
connect_bd_net [get_bd_pins iodelay_if_1/iodly_25__tap] [get_bd_pins v2nfc_7/iDQ1IDelayTap]
connect_bd_net [get_bd_pins iodelay_if_1/iodly_25__tap_load] [get_bd_pins v2nfc_7/iDQ1IDelayTapLoad]
connect_bd_net [get_bd_pins iodelay_if_1/iodly_26__tap] [get_bd_pins v2nfc_7/iDQ2IDelayTap]
connect_bd_net [get_bd_pins iodelay_if_1/iodly_26__tap_load] [get_bd_pins v2nfc_7/iDQ2IDelayTapLoad]
connect_bd_net [get_bd_pins iodelay_if_1/iodly_27__tap] [get_bd_pins v2nfc_7/iDQ3IDelayTap]
